# EAGLE board SP-PC-1 (EAGLE 7.7.0), part 1 of 2
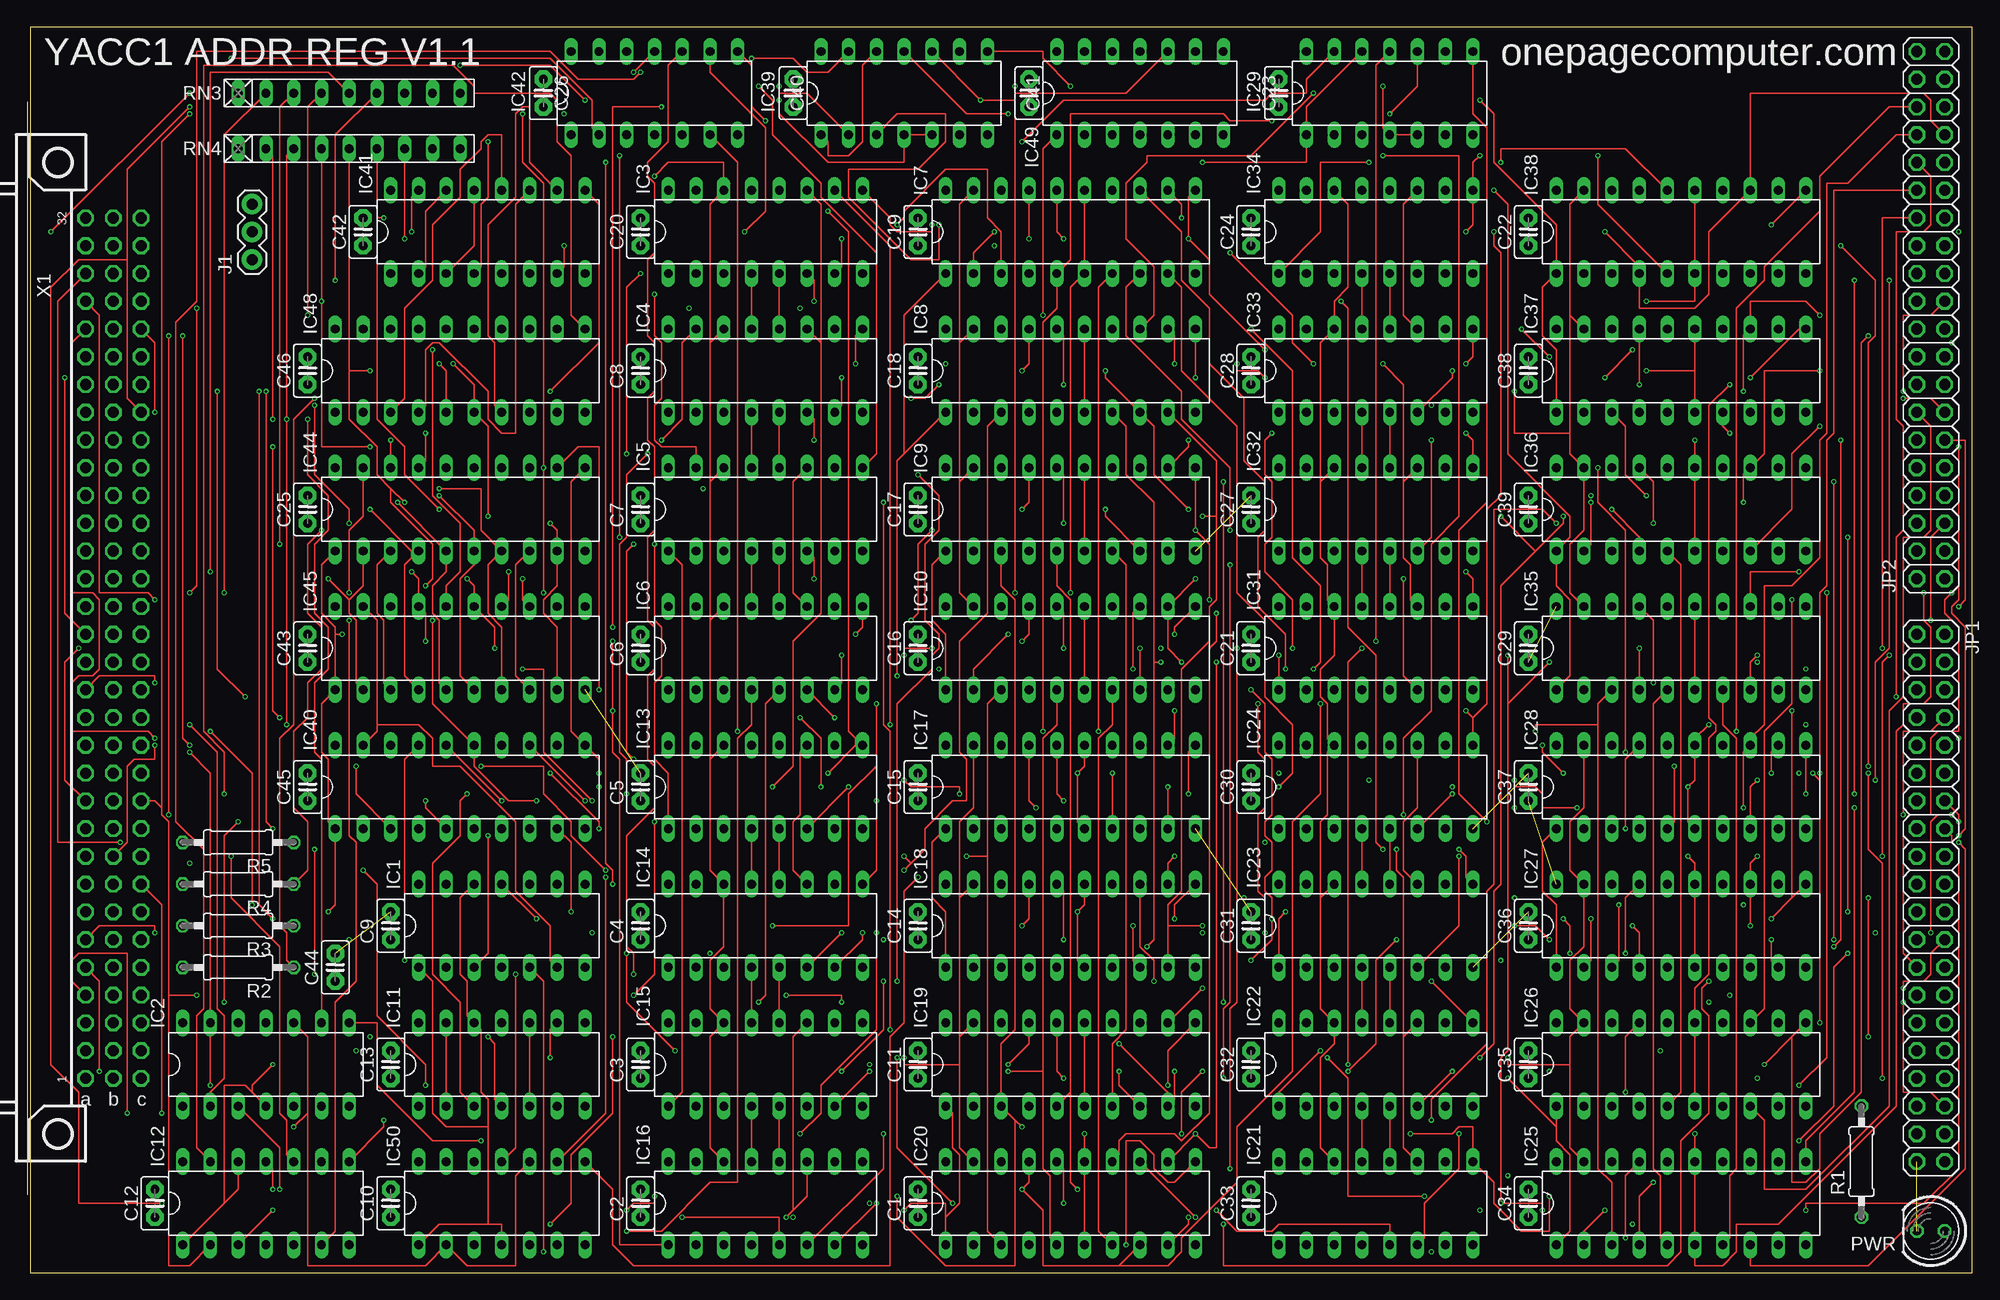
[diagram p8: board, top side]
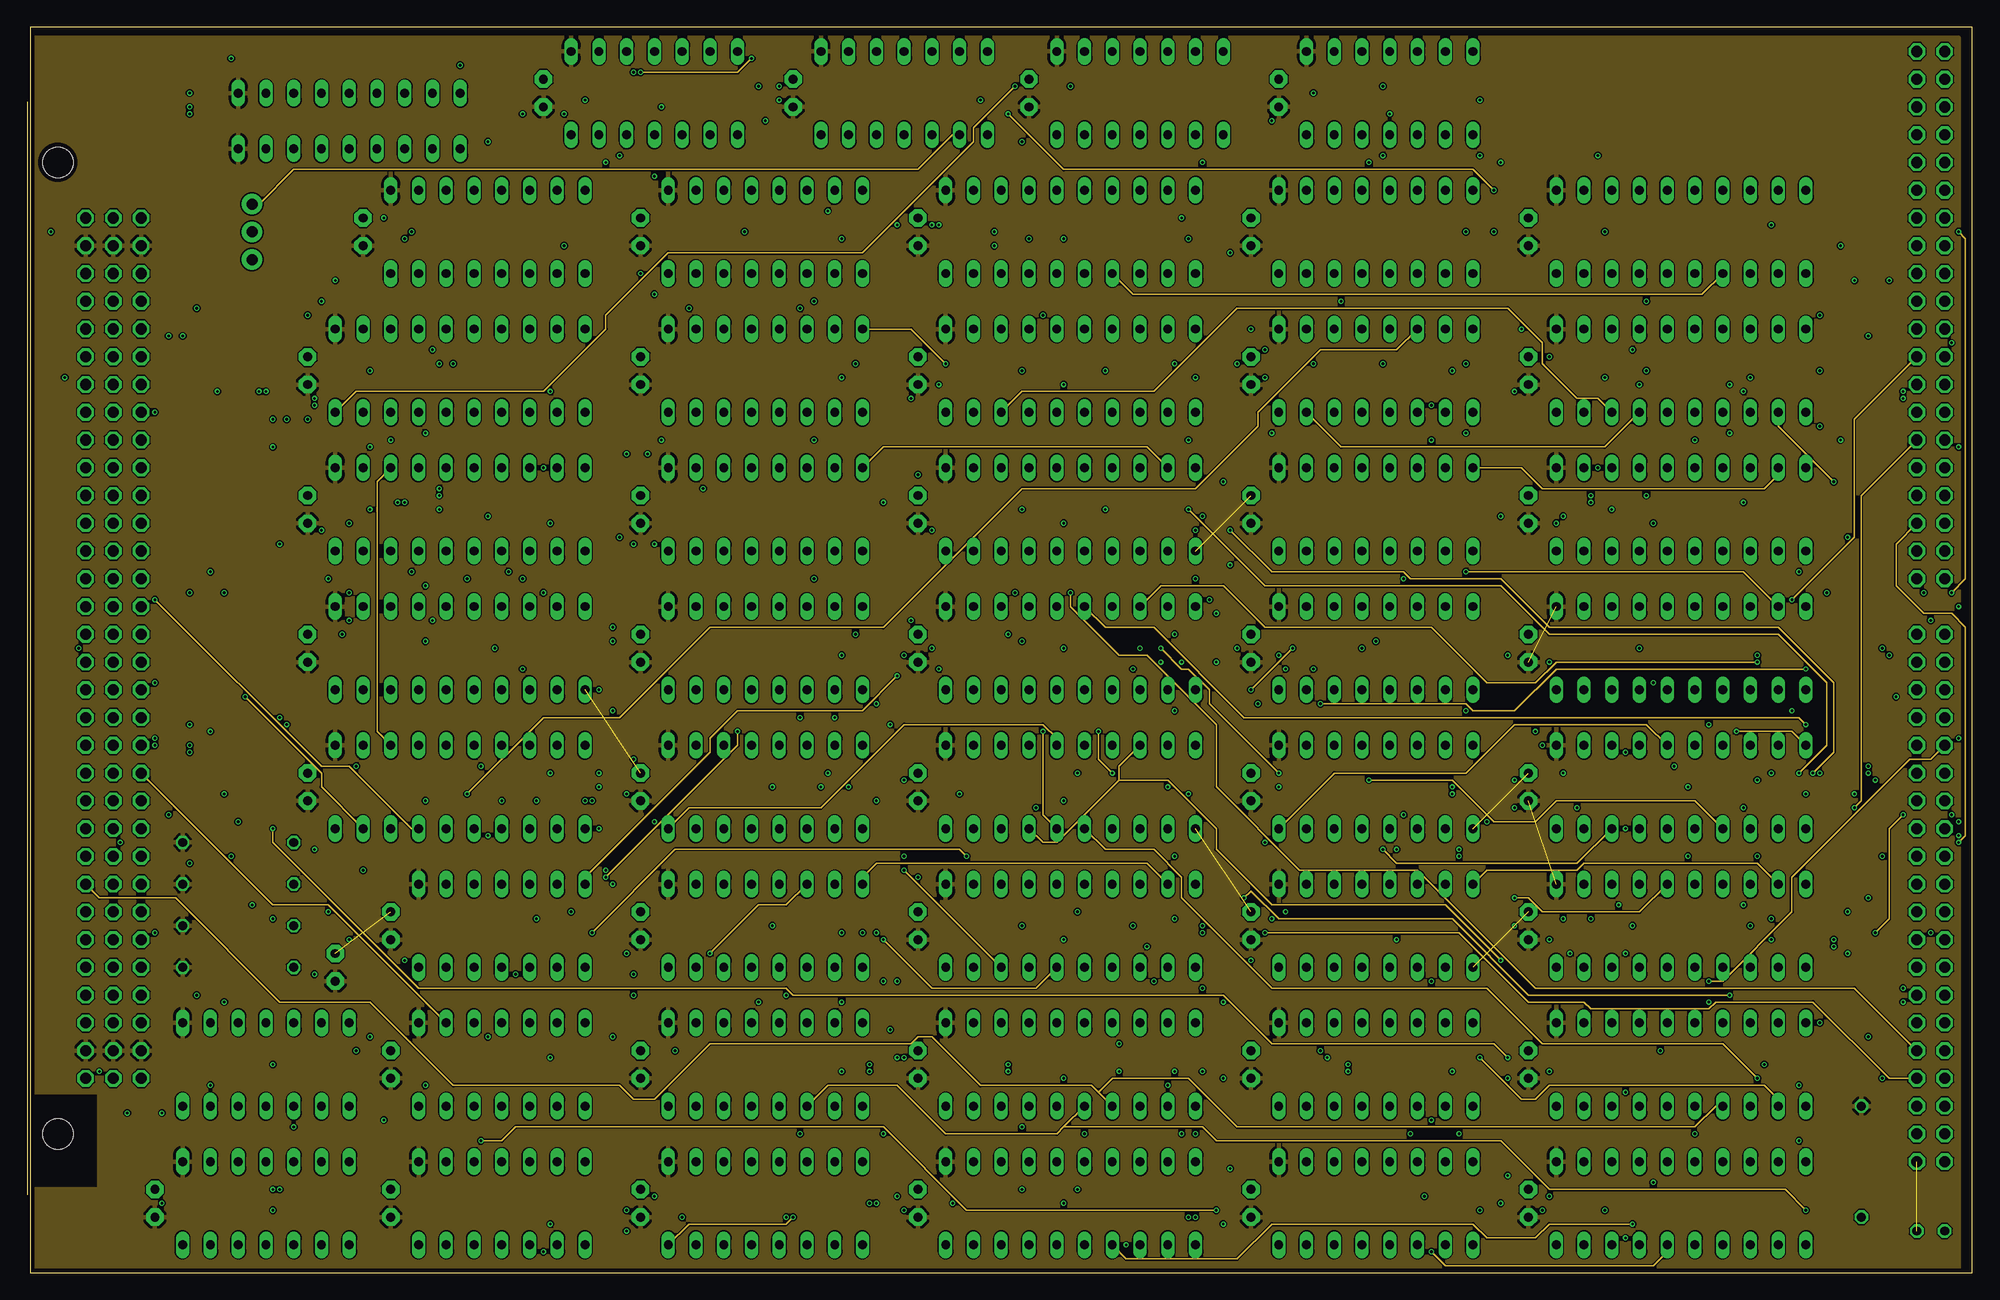
[diagram p9: board, inner layer Route2]
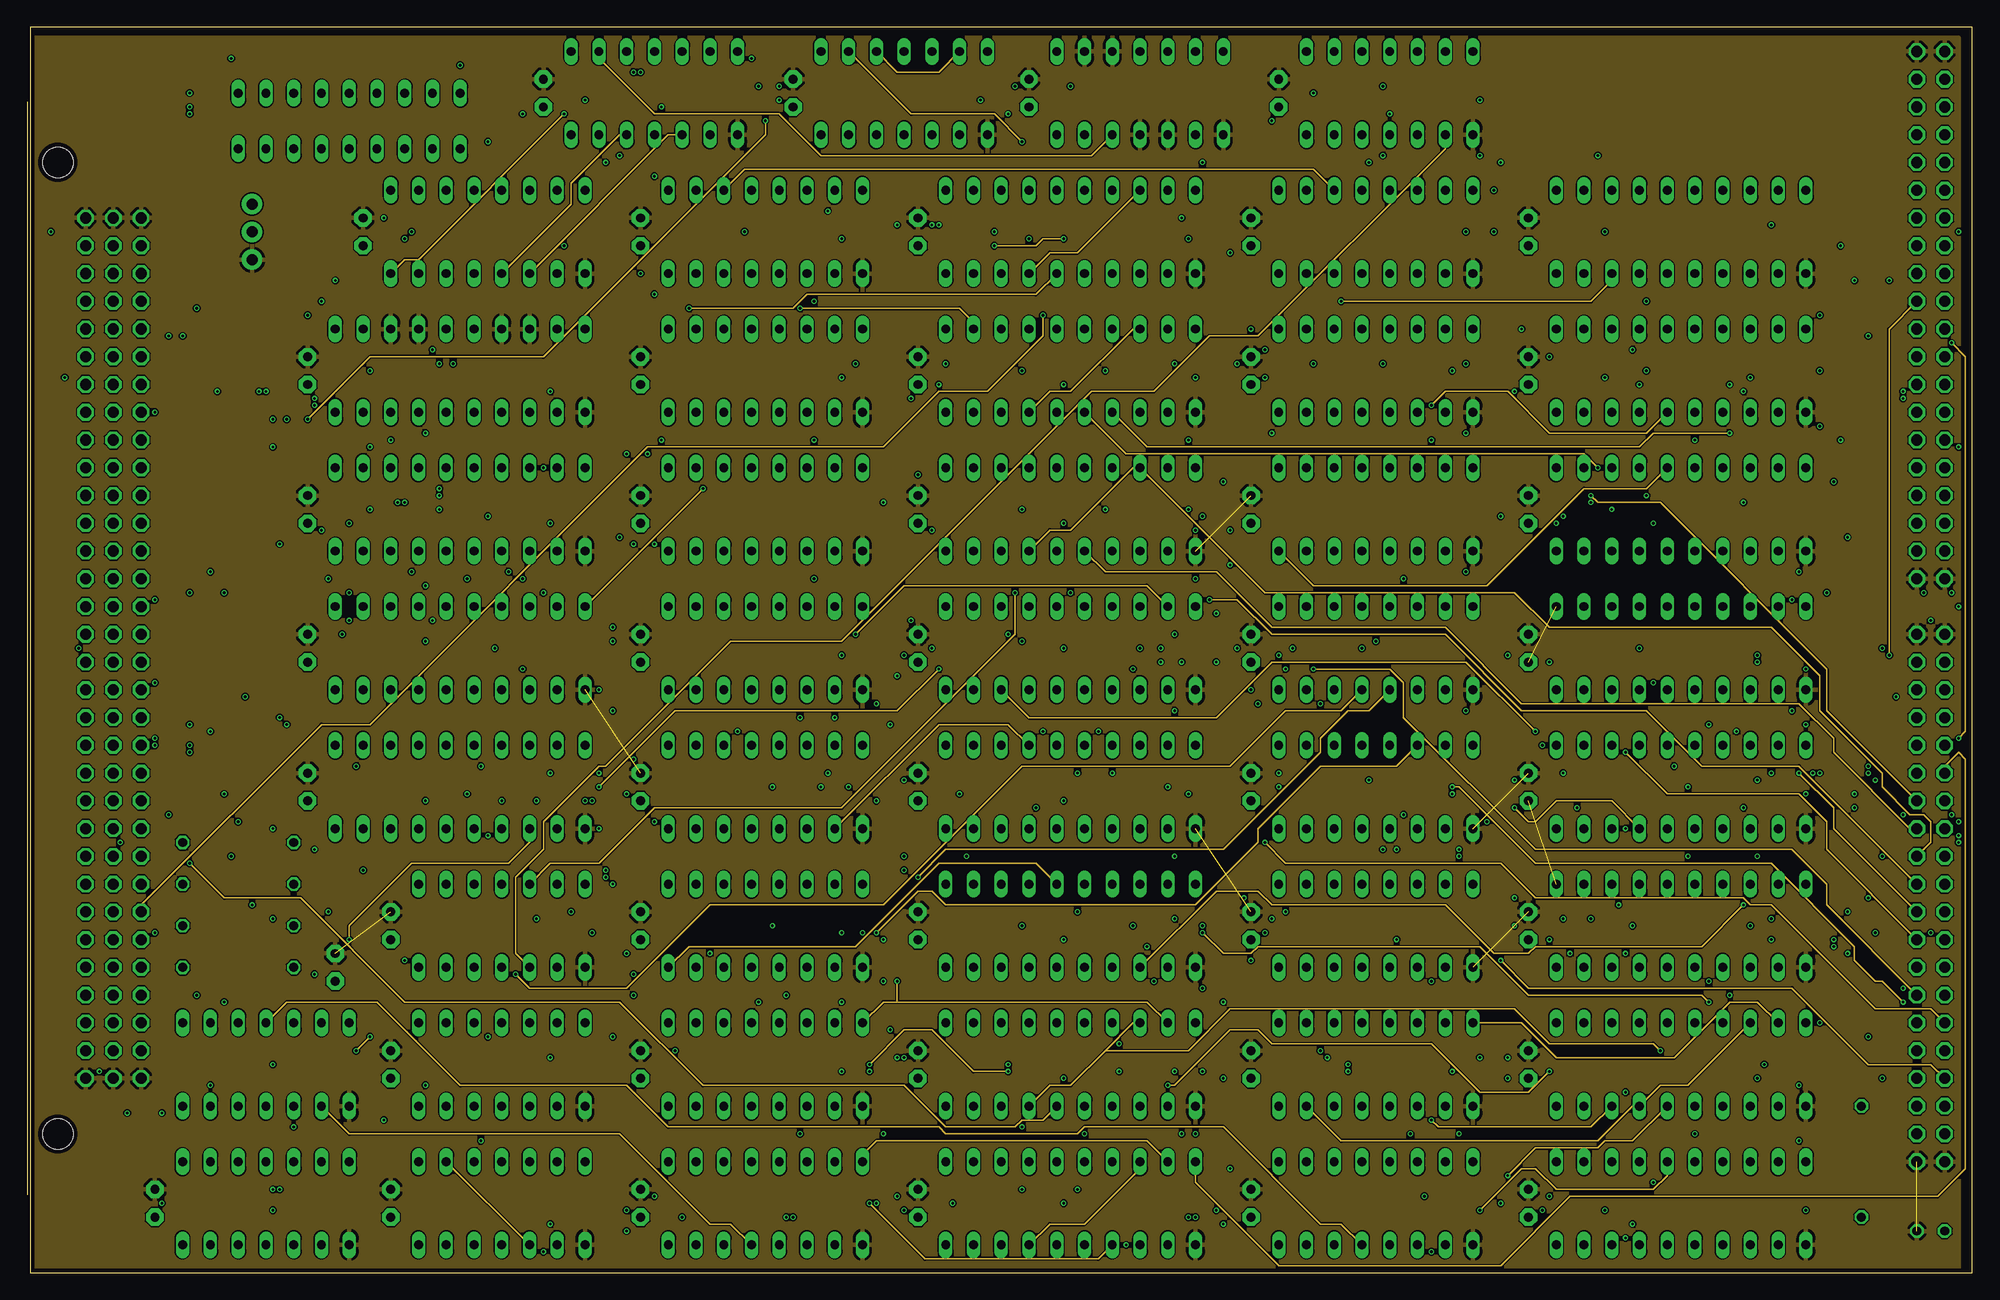
[diagram p10: board, inner layer Route15]
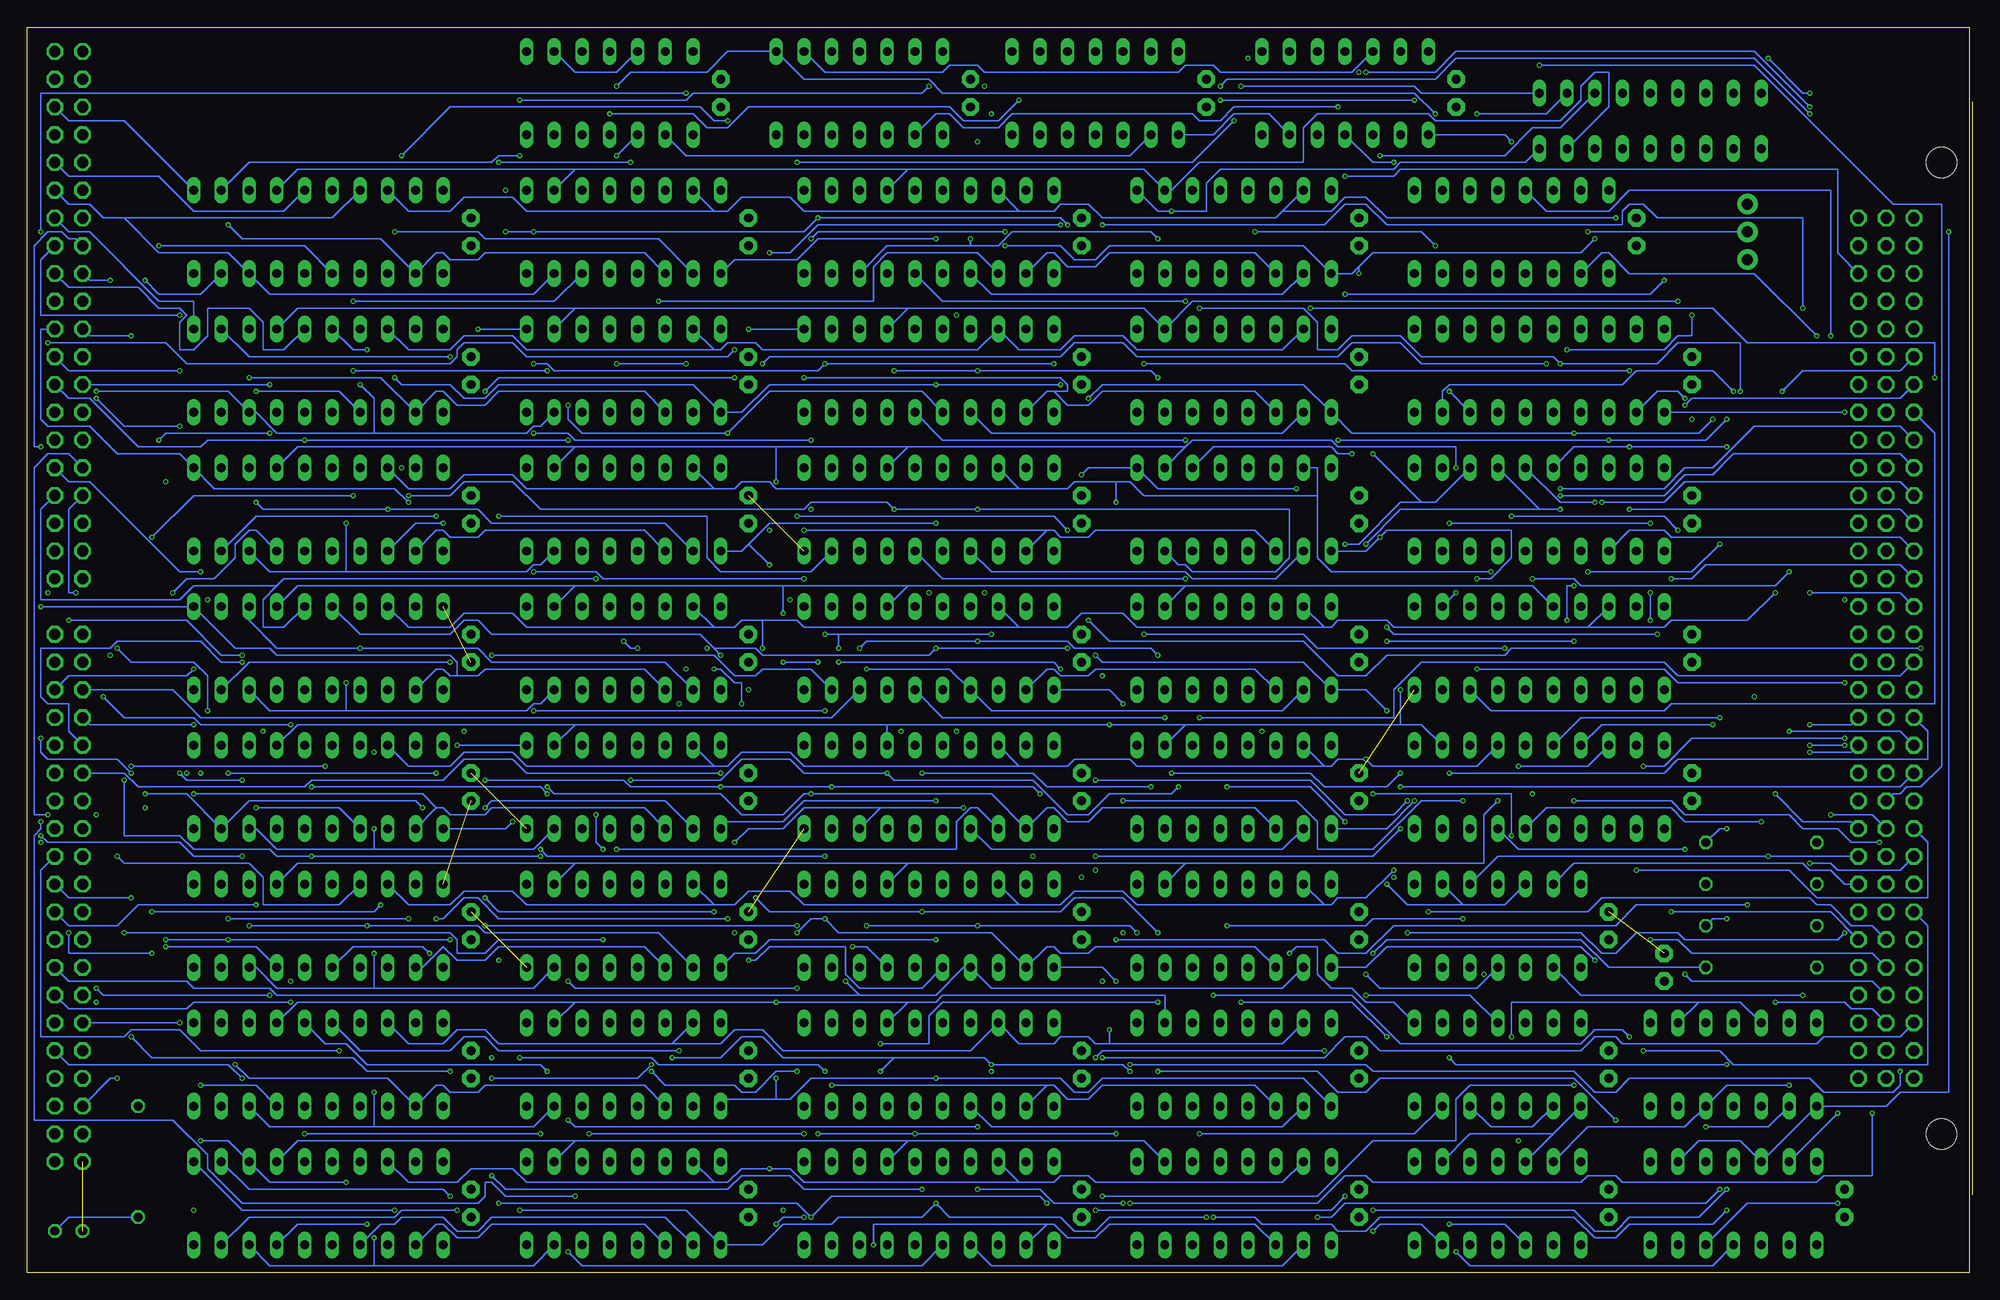
[diagram p11: board, bottom side, seen from below]

Size 177.78 x 113.97 mm. Coordinates in mm from the lower left corner, seen from the top.
Outline: 0,0 177.78,0 177.78,113.97 0,113.97 0,0
Copper layers (1*2*15*16): Top 0.035559375mm / dielectric 0.17018125mm / Route2 0.01778125mm / dielectric 47mil / Route15 0.01778125mm / dielectric 0.17018125mm / Bottom 0.035559375mm
Design rules "OSHPark-4layer *": minimum track width 5mil, minimum drill 10mil, track to track 5mil, track to pad 5mil, pad to pad 5mil, via to via 5mil, smd to smd 5mil, copper to edge 15mil, drill to drill 6mil, minimum pad ring 4mil, minimum via ring 4mil, stop-mask expansion 2.5mil, vias tented up to drill 0mil, thermal gap 10mil

## Footprints (pad centres in the part's own frame; a part is rotated, then mirrored left to right if it is on the bottom)
C2.5-2 = drill 0.813 pad 1.6 octagon: 1 -1.27,0; 2 1.27,0
DIL14 = drill 0.813 long: 1 -7.62,-3.81; 2 -5.08,-3.81; 3 -2.54,-3.81; 4 0,-3.81; 5 2.54,-3.81; 6 5.08,-3.81; 7 7.62,-3.81; 8 7.62,3.81; 9 5.08,3.81; 10 2.54,3.81; 11 0,3.81; 12 -2.54,3.81; 13 -5.08,3.81; 14 -7.62,3.81
DIL16 = drill 0.813 long: 1 -8.89,-3.81; 2 -6.35,-3.81; 3 -3.81,-3.81; 4 -1.27,-3.81; 5 1.27,-3.81; 6 3.81,-3.81; 7 6.35,-3.81; 8 8.89,-3.81; 9 8.89,3.81; 10 6.35,3.81; 11 3.81,3.81; 12 1.27,3.81; 13 -1.27,3.81; 14 -3.81,3.81; 15 -6.35,3.81; 16 -8.89,3.81
DIL20 = drill 0.813 long: 1 -11.43,-3.81; 2 -8.89,-3.81; 3 -6.35,-3.81; 4 -3.81,-3.81; 5 -1.27,-3.81; 6 1.27,-3.81; 7 3.81,-3.81; 8 6.35,-3.81; 9 8.89,-3.81; 10 11.43,-3.81; 11 11.43,3.81; 12 8.89,3.81; 13 6.35,3.81; 14 3.81,3.81; 15 1.27,3.81; 16 -1.27,3.81; 17 -3.81,3.81; 18 -6.35,3.81; 19 -8.89,3.81; 20 -11.43,3.81
1X03 = drill 1.016 pad 1.88: 1 0,0; 2 2.54,0; 3 5.08,0
2X20 = drill 1.016 octagon: 1 -24.13,-1.27; 2 -24.13,1.27; 3 -21.59,-1.27; 4 -21.59,1.27; 5 -19.05,-1.27; 6 -19.05,1.27; 7 -16.51,-1.27; 8 -16.51,1.27; 9 -13.97,-1.27; 10 -13.97,1.27; 11 -11.43,-1.27; 12 -11.43,1.27; 13 -8.89,-1.27; 14 -8.89,1.27; 15 -6.35,-1.27; 16 -6.35,1.27; 17 -3.81,-1.27; 18 -3.81,1.27; 19 -1.27,-1.27; 20 -1.27,1.27; 21 1.27,-1.27; 22 1.27,1.27; 23 3.81,-1.27; 24 3.81,1.27; 25 6.35,-1.27; 26 6.35,1.27; 27 8.89,-1.27; 28 8.89,1.27; 29 11.43,-1.27; 30 11.43,1.27; 31 13.97,-1.27; 32 13.97,1.27; 33 16.51,-1.27; 34 16.51,1.27; 35 19.05,-1.27; 36 19.05,1.27; 37 21.59,-1.27; 38 21.59,1.27; 39 24.13,-1.27; 40 24.13,1.27
LED5MM = drill 0.813 octagon: A -1.27,0; K 1.27,0
0207/10 = drill 0.813 octagon: 1 -5.08,0; 2 5.08,0
RN-9 = drill 0.813 long: 1 -10.16,0; 2 -7.62,0; 3 -5.08,0; 4 -2.54,0; 5 0,0; 6 2.54,0; 7 5.08,0; 8 7.62,0; 9 10.16,0
FABC96R = drill 1.016 octagon: A1 -2.54,39.37; A2 -2.54,36.83; A3 -2.54,34.29; A4 -2.54,31.75; A5 -2.54,29.21; A6 -2.54,26.67; A7 -2.54,24.13; A8 -2.54,21.59; A9 -2.54,19.05; A10 -2.54,16.51; A11 -2.54,13.97; A12 -2.54,11.43; A13 -2.54,8.89; A14 -2.54,6.35; A15 -2.54,3.81; A16 -2.54,1.27; A17 -2.54,-1.27; A18 -2.54,-3.81; A19 -2.54,-6.35; A20 -2.54,-8.89; A21 -2.54,-11.43; A22 -2.54,-13.97; A23 -2.54,-16.51; A24 -2.54,-19.05; A25 -2.54,-21.59; A26 -2.54,-24.13; A27 -2.54,-26.67; A28 -2.54,-29.21; A29 -2.54,-31.75; A30 -2.54,-34.29; A31 -2.54,-36.83; A32 -2.54,-39.37; B1 -5.08,39.37; B2 -5.08,36.83; B3 -5.08,34.29; B4 -5.08,31.75; B5 -5.08,29.21; B6 -5.08,26.67; B7 -5.08,24.13; B8 -5.08,21.59; B9 -5.08,19.05; B10 -5.08,16.51; B11 -5.08,13.97; B12 -5.08,11.43; B13 -5.08,8.89; B14 -5.08,6.35; B15 -5.08,3.81; B16 -5.08,1.27; B17 -5.08,-1.27; B18 -5.08,-3.81; B19 -5.08,-6.35; B20 -5.08,-8.89; B21 -5.08,-11.43; B22 -5.08,-13.97; B23 -5.08,-16.51; B24 -5.08,-19.05; B25 -5.08,-21.59; B26 -5.08,-24.13; B27 -5.08,-26.67; B28 -5.08,-29.21; B29 -5.08,-31.75; B30 -5.08,-34.29; B31 -5.08,-36.83; B32 -5.08,-39.37; C1 -7.62,39.37; C2 -7.62,36.83; C3 -7.62,34.29; C4 -7.62,31.75; C5 -7.62,29.21; C6 -7.62,26.67; C7 -7.62,24.13; C8 -7.62,21.59; C9 -7.62,19.05; C10 -7.62,16.51; C11 -7.62,13.97; C12 -7.62,11.43; C13 -7.62,8.89; C14 -7.62,6.35; C15 -7.62,3.81; C16 -7.62,1.27; C17 -7.62,-1.27; C18 -7.62,-3.81; C19 -7.62,-6.35; C20 -7.62,-8.89; C21 -7.62,-11.43; C22 -7.62,-13.97; C23 -7.62,-16.51; C24 -7.62,-19.05; C25 -7.62,-21.59; C26 -7.62,-24.13; C27 -7.62,-26.67; C28 -7.62,-29.21; C29 -7.62,-31.75; C30 -7.62,-34.29; C31 -7.62,-36.83; C32 -7.62,-39.37 | hole 2.794: 0,-44.456; 0,44.456

## Placement (x,y rotation side)
C1  0.1  [C2.5-2]  81.28,6.35 90 top
C2  0.1  [C2.5-2]  55.88,6.35 90 top
C3  0.1  [C2.5-2]  55.88,19.05 90 top
C4  0.1  [C2.5-2]  55.88,31.75 90 top
C5  0.1  [C2.5-2]  55.88,44.45 90 top
C6  0.1  [C2.5-2]  55.88,57.15 90 top
C7  0.1  [C2.5-2]  55.88,69.85 90 top
C8  0.1  [C2.5-2]  55.88,82.55 90 top
C9  0.1  [C2.5-2]  33.02,31.75 90 top
C10  0.1  [C2.5-2]  33.02,6.35 90 top
C11  0.1  [C2.5-2]  81.28,19.05 90 top
C12  0.1  [C2.5-2]  11.43,6.35 90 top
C13  0.1  [C2.5-2]  33.02,19.05 90 top
C14  0.1  [C2.5-2]  81.28,31.75 90 top
C15  0.1  [C2.5-2]  81.28,44.45 90 top
C16  0.1  [C2.5-2]  81.28,57.15 90 top
C17  0.1  [C2.5-2]  81.28,69.85 90 top
C18  0.1  [C2.5-2]  81.28,82.55 90 top
C19  0.1  [C2.5-2]  81.28,95.25 90 top
C20  0.1  [C2.5-2]  55.88,95.25 90 top
C21  0.1  [C2.5-2]  111.76,57.15 90 top
C22  0.1  [C2.5-2]  137.16,95.25 90 top
C23  0.1  [C2.5-2]  114.3,107.95 90 top
C24  0.1  [C2.5-2]  111.76,95.25 90 top
C25  0.1  [C2.5-2]  25.4,69.85 90 top
C26  0.1  [C2.5-2]  46.99,107.95 90 top
C27  0.1  [C2.5-2]  111.76,69.85 90 top
C28  0.1  [C2.5-2]  111.76,82.55 90 top
C29  0.1  [C2.5-2]  137.16,57.15 90 top
C30  0.1  [C2.5-2]  111.76,44.45 90 top
C31  0.1  [C2.5-2]  111.76,31.75 90 top
C32  0.1  [C2.5-2]  111.76,19.05 90 top
C33  0.1  [C2.5-2]  111.76,6.35 90 top
C34  0.1  [C2.5-2]  137.16,6.35 90 top
C35  0.1  [C2.5-2]  137.16,19.05 90 top
C36  0.1  [C2.5-2]  137.16,31.75 90 top
C37  0.1  [C2.5-2]  137.16,44.45 90 top
C38  0.1  [C2.5-2]  137.16,82.55 90 top
C39  0.1  [C2.5-2]  137.16,69.85 90 top
C40  0.1  [C2.5-2]  69.85,107.95 90 top
C41  0.1  [C2.5-2]  91.44,107.95 90 top
C42  0.1  [C2.5-2]  30.48,95.25 90 top
C43  0.1  [C2.5-2]  25.4,57.15 90 top
C44  0.1  [C2.5-2]  27.94,27.94 90 top
C45  0.1  [C2.5-2]  25.4,44.45 90 top
C46  0.1  [C2.5-2]  25.4,82.55 90 top
IC1  7400N  [DIL14]  43.18,31.75 0 top
IC2  74LS08N  [DIL14]  21.59,19.05 0 top
IC3  74LS192N  [DIL16]  67.31,95.25 0 top
IC4  74LS192N  [DIL16]  67.31,82.55 0 top
IC5  74LS192N  [DIL16]  67.31,69.85 0 top
IC6  74LS192N  [DIL16]  67.31,57.15 0 top
IC7  74LS244N  [DIL20]  95.25,95.25 0 top
IC8  74LS244N  [DIL20]  95.25,82.55 0 top
IC9  74LS244N  [DIL20]  95.25,69.85 0 top
IC10  74LS244N  [DIL20]  95.25,57.15 0 top
IC11  7400N  [DIL14]  43.18,19.05 0 top
IC12  7400N  [DIL14]  21.59,6.35 0 top
IC13  74LS192N  [DIL16]  67.31,44.45 0 top
IC14  74LS192N  [DIL16]  67.31,31.75 0 top
IC15  74LS192N  [DIL16]  67.31,19.05 0 top
IC16  74LS192N  [DIL16]  67.31,6.35 0 top
IC17  74LS244N  [DIL20]  95.25,44.45 0 top
IC18  74LS244N  [DIL20]  95.25,31.75 0 top
IC19  74LS244N  [DIL20]  95.25,19.05 0 top
IC20  74LS244N  [DIL20]  95.25,6.35 0 top
IC21  74LS192N  [DIL16]  123.19,6.35 0 top
IC22  74LS192N  [DIL16]  123.19,19.05 0 top
IC23  74LS192N  [DIL16]  123.19,31.75 0 top
IC24  74LS192N  [DIL16]  123.19,44.45 0 top
IC25  74LS244N  [DIL20]  151.13,6.35 0 top
IC26  74LS244N  [DIL20]  151.13,19.05 0 top
IC27  74LS244N  [DIL20]  151.13,31.75 0 top
IC28  74LS244N  [DIL20]  151.13,44.45 0 top
IC29  7400N  [DIL14]  124.46,107.95 0 top
IC31  74LS192N  [DIL16]  123.19,57.15 0 top
IC32  74LS192N  [DIL16]  123.19,69.85 0 top
IC33  74LS192N  [DIL16]  123.19,82.55 0 top
IC34  74LS192N  [DIL16]  123.19,95.25 0 top
IC35  74LS244N  [DIL20]  151.13,57.15 0 top
IC36  74LS244N  [DIL20]  151.13,69.85 0 top
IC37  74LS244N  [DIL20]  151.13,82.55 0 top
IC38  74LS244N  [DIL20]  151.13,95.25 0 top
IC39  7400N  [DIL14]  80.01,107.95 0 top
IC40  74LS245N  [DIL20]  39.37,44.45 0 top
IC41  74LS139N  [DIL16]  41.91,95.25 0 top
IC42  74LS04N  [DIL14]  57.15,107.95 0 top
IC44  74LS245N  [DIL20]  39.37,69.85 0 top
IC45  74LS245N  [DIL20]  39.37,57.15 0 top
IC48  74LS374N  [DIL20]  39.37,82.55 0 top
IC49  74LS32N  [DIL14]  101.6,107.95 0 top
IC50  74LS08N  [DIL14]  43.18,6.35 0 top
J1  [1X03]  20.32,92.71 90 top
JP1  [2X20]  173.99,34.29 270 top
JP2  [2X20]  173.99,87.63 90 top
PWR  l1  [LED5MM]  173.99,3.81 180 top
R1  330  [0207/10]  167.64,10.16 90 top
R2  10k  [0207/10]  19.05,27.94 180 top
R3  10k  [0207/10]  19.05,31.75 180 top
R4  10k  [0207/10]  19.05,35.56 180 top
R5  10k  [0207/10]  19.05,39.37 180 top
RN3  [RN-9]  29.21,107.95 0 top
RN4  [RN-9]  29.21,102.87 0 top
X1  FABC96R  [FABC96R]  2.54,57.15 180 top

## Tracks (layer width: path | path; a pad name or v marks a point on that pad's centre or on a via)
-BUS-EN  (via drill 0.25)
  Top 0.127: v11.43,78.74 11.43,85.09 X1.C28 | IC49.10 100.33,107.95 90.17,107.95 v90.17,108.58
  Route2 0.127: v90.17,108.58 86.36,104.78 86.36,103.5 76.2,93.34 58.42,93.34 52.7,87.63 52.7,86.36 46.99,80.64 29.84,80.64 IC48.1
  Bottom 0.127: v11.43,78.74 IC48.1
-INDIRECT0
  Route15 0.127: IC41.6 58.42,104.14 IC42.5
-INDIRECT1  (via drill 0.25)
  Top 0.127: IC41.7 48.9,92.08 v48.9,93.98 | v65.41,95.25 67.31,97.16 67.31,104.78 62.23,109.86 IC42.9
  Bottom 0.127: v48.9,93.98 50.16,95.25 v65.41,95.25
-IREG0-ADDR-OUT  (via drill 0.25)
  Top 0.127: IC35.19 140.97,62.23 140.97,66.67 142.24,67.94 IC36.19 140.97,74.93 140.97,76.83 | 140.97,87.63 IC37.19 | 140.97,87.63 140.97,97.79 IC38.19 | 140.97,87.63 140.97,76.83 | R4.1 25.4,36.83 25.4,41.27 24.13,42.55 24.13,49.53 25.4,50.8 25.4,53.98 26.67,55.24 26.67,59.05 25.4,60.33 25.4,66.67 v26.67,67.94 | v41.91,69.22 41.91,77.47 IC48.6 40.64,81.28 v38.73,83.19 | 140.97,76.83 135.89,76.83 v135.89,80.64 | v113.03,81.92 112.39,82.55 110.49,82.55 v110.49,83.19
  Bottom 0.127: v26.67,67.94 27.94,69.22 v41.91,69.22 | v135.89,80.64 134.62,81.92 v113.03,81.92 | v110.49,83.19 109.86,83.82 83.19,83.82 81.92,85.09 77.47,85.09 76.2,83.82 57.78,83.82 56.52,85.09 52.07,85.09 50.16,83.19 v38.73,83.19
-IREG1-ADDR-OUT  (via drill 0.25)
  Top 0.127: IC25.19 140.97,11.43 140.97,19.05 | 140.97,19.05 140.97,21.59 IC26.19 140.97,24.13 140.97,28.57 142.24,29.84 IC27.19 140.97,36.83 140.97,41.27 142.24,42.55 IC28.19 | v22.23,40.64 21.59,41.27 v21.59,80.64 | 140.97,19.05 135.25,19.05 v135.25,19.68
  Route2 0.127: v135.25,19.68 133.99,20.95 113.67,20.95 109.22,25.4 69.85,25.4 69.22,26.04 35.56,26.04 22.23,39.37 v22.23,40.64
  Bottom 0.127: R5.1 22.86,40.64 v22.23,40.64 | v21.59,80.64 23.5,82.55 30.48,82.55 31.75,81.28 47.62,81.28 48.26,80.64 IC48.9
-PC
  Route15 0.127: IC41.5 49.53,97.79 49.53,99.69 53.98,104.14 IC42.3
-PC-ADDR-OUT  (via drill 0.25)
  Top 0.127: IC20.19 85.09,11.43 85.09,19.05 | 85.09,21.59 85.09,19.05 | IC19.19 85.09,21.59 | 85.09,34.29 IC18.19 | 85.09,21.59 85.09,34.29 | IC17.19 86.36,42.55 85.09,41.27 85.09,34.29 | R2.1 23.5,28.57 23.5,31.11 22.86,31.75 22.86,48.9 24.13,50.16 24.13,78.11 v26.04,80.01 | 85.09,19.05 80.01,19.05 v80.01,19.68 | v59.05,20.32 54.61,24.77 v54.61,29.21
  Bottom 0.127: v26.04,80.01 26.67,80.64 28.57,80.64 IC48.2 | v80.01,19.68 79.38,20.32 v59.05,20.32 | v54.61,29.21 53.34,30.48 35.56,30.48 33.02,27.94 R2.1
-SP  (via drill 0.25)
  Top 0.127: IC41.4 41.27,92.08 41.27,97.79 41.91,98.42 v41.91,103.5
  Bottom 0.127: v41.91,103.5 42.55,104.14 IC42.1
-SP-ADDR-OUT  (via drill 0.25)
  Top 0.127: IC10.19 85.09,62.23 85.09,72.39 | IC9.19 85.09,72.39 | 85.09,85.09 IC8.19 | 85.09,72.39 85.09,85.09 | IC7.19 85.09,97.79 85.09,85.09 | v22.23,32.38 20.95,33.66 v20.95,80.64 | v37.47,83.19 38.1,82.55 IC48.5
  Route15 0.127: IC8.19 86.36,87 85.09,88.27 v70.48,88.27
  Bottom 0.127: R3.1 23.5,32.38 v22.23,32.38 | v20.95,80.64 20.95,85.09 26.67,85.09 28.57,83.19 v37.47,83.19 38.1,83.82 50.16,83.82 52.07,85.72 56.52,85.72 57.78,84.45 59.69,84.45 59.69,87 60.96,88.27 v70.48,88.27
ADATA0  (via drill 0.25)
  Top 0.127: RN3.2 17.78,104.14 v17.78,62.23 | v109.86,9.53 109.86,24.13 110.49,24.77 v110.49,57.15
  Bottom 0.127: IC16.15 62.87,8.26 80.01,8.26 80.64,8.89 83.19,8.89 83.82,8.26 87,8.26 | IC20.18 87,8.26 | 114.94,8.26 IC21.15 | 114.94,8.26 113.67,8.26 112.39,9.53 v109.86,9.53 107.95,9.53 106.68,8.26 87,8.26 | IC25.18 142.88,8.26 138.43,8.26 137.16,9.53 133.35,9.53 132.08,8.26 114.94,8.26 | 34.92,59.05 IC45.18 | 34.92,59.05 52.7,59.05 53.34,59.69 57.78,59.69 58.42,59.05 59.05,59.05 | IC6.15 59.05,59.05 | 87,59.05 IC10.18 | 87,59.05 82.55,59.05 81.28,60.33 77.47,60.33 76.2,59.05 59.05,59.05 | 114.94,59.05 IC31.15 | 114.94,59.05 113.03,59.05 112.39,59.69 110.49,59.69 | 110.49,59.69 107.31,59.69 106.68,59.05 87,59.05 | IC35.18 142.88,59.05 139.06,59.05 137.79,60.33 133.35,60.33 132.08,59.05 114.94,59.05 | v17.78,62.23 20.32,59.69 27.3,59.69 27.94,59.05 34.92,59.05 | 110.49,59.69 v110.49,57.15
ADATA1  (via drill 0.25)
  Top 0.127: v114.3,56.52 IC31.1 | IC10.16 94.61,60.33 v94.61,57.15 | IC20.16 94.61,9.53 v94.61,6.35 | IC16.1 53.98,2.54 53.98,46.99 53.34,47.62 v53.34,51.44 v53.34,57.78 | v36.2,57.78 36.2,60.33 IC45.17 35.56,63.5 v34.92,64.14 | RN3.3 22.86,106.68 v22.86,66.67 | v82.55,57.15 80.01,57.15 v80.01,56.52
  Route2 0.127: v69.85,5.08 69.22,4.45 60.33,4.45 IC16.1
  Route15 0.127: IC25.16 149.86,8.89 148.59,7.62 139.7,7.62 137.79,9.53 136.53,9.53 v132.72,5.71
  Bottom 0.127: 114.94,57.15 116.2,58.42 135.25,58.42 136.53,59.69 137.79,59.69 139.06,58.42 147.32,58.42 IC35.16 | 114.94,57.15 v114.3,56.52 | 114.94,57.15 111.12,57.15 110.49,56.52 95.25,56.52 v94.61,57.15 v82.55,57.15 | v132.72,5.71 117.47,5.71 IC21.1 110.49,2.54 108.58,4.45 104.14,4.45 103.5,5.08 95.89,5.08 v94.61,6.35 93.34,5.08 83.19,5.08 81.92,3.81 80.01,3.81 78.74,5.08 v69.85,5.08 | v53.34,51.44 55.24,53.34 IC6.1 60.96,55.88 79.38,55.88 v80.01,56.52 | v53.34,57.78 v36.2,57.78 | v22.86,66.67 25.4,64.14 v34.92,64.14
ADATA2  (via drill 0.25)
  Top 0.127: RN3.4 25.4,106.68 v25.4,87.63 | v36.83,84.45 36.83,71.12 39.37,68.58 39.37,64.14 38.1,62.87 IC45.16 | IC20.14 99.69,10.79 99.69,12.06 100.33,12.7 104.78,12.7 105.41,12.06 107.95,14.61 107.95,57.15 108.58,57.78 v108.58,60.33
  Bottom 0.127: IC16.10 75.56,12.06 97.16,12.06 | IC20.14 97.16,12.06 | 127.64,12.06 IC21.10 | 97.16,12.06 127.64,12.06 | IC25.14 153.03,12.06 127.64,12.06 | IC45.16 40.01,62.87 71.75,62.87 | IC6.10 71.75,62.87 | 97.16,62.87 IC10.14 | 71.75,62.87 97.16,62.87 | v25.4,87.63 25.4,85.72 26.67,85.72 27.94,84.45 v36.83,84.45 | 127.64,62.87 IC31.10 | 97.16,62.87 108.58,62.87 | 108.58,62.87 127.64,62.87 | IC35.14 153.03,62.87 127.64,62.87 | 108.58,62.87 v108.58,60.33
ADATA3  (via drill 0.25)
  Top 0.127: v139.06,6.99 139.06,3.81 136.53,3.81 133.99,6.35 133.99,8.26 IC21.9 132.08,13.34 130.81,13.34 130.18,12.7 v126.36,12.7 | IC20.12 v106.68,12.7 107.95,11.43 108.58,11.43 v108.58,55.88 | v106.68,63.5 IC10.12 104.14,57.15 v105.41,55.88 | v131.44,64.14 132.08,63.5 IC31.9 | v42.55,57.15 42.55,59.05 IC45.15 40.64,62.87 v40.01,63.5 | v75.56,58.42 76.2,59.05 IC6.9 | RN3.5 27.3,109.86 16.51,109.86 v16.51,64.14
  Route2 0.127: IC35.12 156.84,64.14 v131.44,64.14
  Route15 0.127: IC16.9 76.2,10.79 77.47,12.06 102.23,12.06 IC20.12 | IC10.12 102.23,62.87 80.01,62.87 v75.56,58.42
  Bottom 0.127: v139.06,6.99 139.7,7.62 157.48,7.62 IC25.12 | v126.36,12.7 v106.68,12.7 | v106.68,63.5 125.09,63.5 125.73,64.14 v131.44,64.14 | v42.55,57.15 59.69,57.15 60.96,58.42 v75.56,58.42 | v16.51,64.14 17.78,62.87 35.56,62.87 36.2,63.5 v40.01,63.5 | v105.41,55.88 v108.58,55.88
ADATA4  (via drill 0.25)
  Top 0.127: IC45.14 43.81,61.59 v43.81,64.14 | RN3.6 27.94,104.14 v27.94,90.81 | v57.15,89.53 57.15,85.72 57.78,85.09 57.78,80.01 57.15,79.38 57.15,76.2 57.78,75.56 60.96,75.56 IC5.15 | v78.74,22.23 78.74,49.53 78.11,50.16 v78.11,70.48
  Bottom 0.127: IC15.15 62.87,20.95 78.74,20.95 | 78.74,20.95 80.01,20.95 80.64,21.59 83.19,21.59 83.82,20.95 87,20.95 IC19.18 91.44,20.32 108.58,20.32 110.49,22.23 113.03,22.23 114.3,20.95 118.75,20.95 | 118.75,20.95 IC22.15 | 118.75,20.95 134.62,20.95 135.89,22.23 138.43,22.23 139.7,20.95 142.88,20.95 IC26.18 | v43.81,64.14 58.42,64.14 59.69,65.41 59.69,71.12 | 59.69,71.12 59.69,73.66 IC5.15 | v27.94,90.81 29.21,89.53 v57.15,89.53 | 87,71.75 IC9.18 | 87,71.75 82.55,71.75 81.92,72.39 78.11,72.39 | 78.11,72.39 76.83,72.39 75.56,71.12 59.69,71.12 | 114.94,71.75 IC32.15 | 114.94,71.75 113.03,71.75 112.39,72.39 109.86,72.39 109.22,71.75 87,71.75 | IC36.18 142.88,71.75 139.06,71.75 137.79,73.03 133.35,73.03 132.08,71.75 114.94,71.75 | v78.74,22.23 78.74,20.95 | 78.11,72.39 v78.11,70.48
ADATA5  (via drill 0.25)
  Top 0.127: IC9.16 94.61,73.03 v94.61,68.58 | v94.61,17.78 93.98,18.41 IC19.16 | v118.11,20.32 114.3,16.51 IC22.1 | IC15.1 59.69,16.51 59.69,64.77 IC5.1 | IC45.13 45.09,61.59 v45.09,63.5 | v53.98,67.31 v53.98,102.23 | v109.86,64.77 109.86,24.77 109.22,24.13 v109.22,17.78
  Route15 0.127: IC36.16 147.96,71.75 142.24,71.75 133.35,62.87 117.47,62.87 IC32.1
  Bottom 0.127: v94.61,68.58 109.86,68.58 111.76,66.67 | 111.76,66.67 112.39,66.04 IC32.1 | IC22.1 113.67,15.88 109.22,15.88 | 109.22,15.88 107.95,15.88 106.05,17.78 v94.61,17.78 83.19,17.78 81.92,16.51 80.64,16.51 79.38,17.78 60.96,17.78 IC15.1 | IC26.16 147.32,20.32 139.06,20.32 137.79,21.59 135.89,21.59 134.62,20.32 v118.11,20.32 | v45.09,63.5 43.81,63.5 41.91,65.41 41.91,67.94 53.34,67.94 v53.98,67.31 55.24,66.04 IC5.1 | RN3.7 37.47,104.78 40.01,104.78 42.55,102.23 v53.98,102.23 | v109.86,64.77 111.76,66.67 | 109.22,15.88 v109.22,17.78
ADATA6  (via drill 0.25)
  Top 0.127: v46.99,62.23 v46.99,73.66 46.99,99.69 45.09,101.6 v45.09,106.05 | v109.22,72.39 v109.22,24.77
  Bottom 0.127: IC15.10 73.66,25.4 93.98,25.4 94.61,24.77 97.16,24.77 | IC19.14 97.16,24.77 | 127.64,24.77 IC22.10 | 97.16,24.77 v109.22,24.77 127.64,24.77 | IC26.14 153.03,24.77 127.64,24.77 | v46.99,62.23 IC45.12 | v46.99,73.66 46.99,75.56 57.78,75.56 58.42,76.2 71.12,76.2 71.75,75.56 | IC5.10 71.75,75.56 | 97.16,75.56 IC9.14 | 71.75,75.56 97.16,75.56 | RN3.8 38.73,106.05 v45.09,106.05 | 127.64,75.56 IC32.10 | 97.16,75.56 109.22,75.56 | 109.22,75.56 127.64,75.56 | IC36.14 153.03,75.56 127.64,75.56 | 109.22,75.56 v109.22,72.39
ADATA7  (via drill 0.25)
  Top 0.127: v128.27,26.67 IC22.9 | IC19.12 v107.31,26.04 | IC9.12 106.05,75.56 v106.05,76.2 | v131.44,76.83 132.08,76.2 IC32.9 | v66.67,108.58 67.94,107.31 67.94,104.14 72.39,99.69 72.39,98.42 77.47,93.34 77.47,74.93 IC5.9 | v79.38,26.67 79.38,52.07 82.55,55.24 82.55,56.52 83.19,57.15 83.19,58.42 81.92,59.69 81.92,66.67 83.19,67.94 83.19,71.12 v81.28,73.03
  Route2 0.127: IC36.12 160.02,73.03 158.75,71.75 138.43,71.75 136.53,73.66 IC32.9 | IC9.12 102.23,75.56 78.11,75.56 IC5.9
  Route15 0.127: IC15.9 78.11,24.77 79.38,24.77 | 79.38,24.77 102.23,24.77 IC19.12 | IC26.12 158.12,24.77 155.57,24.77 150.5,19.68 139.7,19.68 136.53,22.86 IC22.9 | v61.59,71.75 IC45.11 | v79.38,26.67 79.38,24.77
  Bottom 0.127: v128.27,26.67 127.64,26.04 v107.31,26.04 | v106.05,76.2 127.64,76.2 128.27,76.83 v131.44,76.83 | v61.59,71.75 74.3,71.75 IC5.9 80.64,73.66 v81.28,73.03 | RN3.9 50.16,107.95 50.8,108.58 v66.67,108.58
ADATA8  (via drill 0.25)
  Top 0.127: v41.27,46.35 46.99,46.35 46.99,43.81 49.53,41.27 49.53,40.01 v52.7,36.83 | v33.02,76.2 IC44.18 | v57.78,76.2 59.69,78.11 59.69,85.09 IC4.15 | RN4.2 22.23,102.23 v22.23,78.11
  Route2 0.127: IC40.18 31.75,49.53 31.75,72.39 IC44.18
  Bottom 0.127: IC40.18 34.92,46.35 v41.27,46.35 | v52.7,36.83 55.24,34.29 57.78,34.29 58.42,33.66 59.05,33.66 | IC14.15 59.05,33.66 | 87,33.66 IC18.18 | 87,33.66 83.19,33.66 81.92,34.92 77.47,34.92 76.2,33.66 59.05,33.66 | 114.94,33.66 IC23.15 | 114.94,33.66 113.03,33.66 111.76,34.92 107.95,34.92 106.68,33.66 87,33.66 | IC27.18 142.88,33.66 139.06,33.66 137.79,34.92 133.35,34.92 132.08,33.66 114.94,33.66 | 114.94,84.45 114.3,84.45 113.67,85.09 111.12,85.09 110.49,84.45 90.81,84.45 IC8.18 87,84.45 83.19,84.45 81.92,85.72 77.47,85.72 76.2,84.45 62.87,84.45 IC4.15 | IC33.15 114.94,84.45 | IC37.18 142.88,84.45 139.06,84.45 137.79,85.72 133.35,85.72 132.08,84.45 114.94,84.45 | v57.78,76.2 v33.02,76.2 24.13,76.2 v22.23,78.11
ADATA9  (via drill 0.25)
  Top 0.127: IC8.16 94.61,85.72 v94.61,81.28 | v144.15,81.92 v146.69,84.45 | IC18.16 94.61,34.92 v94.61,30.48 | v114.94,33.02 114.3,32.38 IC23.1 | IC40.17 34.29,46.99 v34.29,28.57 | IC44.17 36.2,74.3 v36.2,76.83 | RN4.3 23.5,102.23 v23.5,78.11 v23.5,50.16 | v83.19,81.28 81.92,80.01 v80.64,80.01
  Route2 0.127: IC27.16 147.32,33.02 138.43,33.02 137.16,34.29 v135.89,34.29
  Route15 0.127: IC18.16 92.08,37.47 83.19,37.47 75.56,29.84 60.33,29.84 IC14.1
  Bottom 0.127: IC37.16 147.96,84.45 v146.69,84.45 | v144.15,81.92 143.51,81.28 139.06,81.28 137.79,80.01 135.89,80.01 134.62,81.28 116.84,81.28 IC33.1 112.39,78.74 109.86,81.28 v94.61,81.28 v83.19,81.28 | v94.61,30.48 109.86,30.48 111.12,29.21 113.03,29.21 IC23.1 | v135.89,34.29 134.62,33.02 v114.94,33.02 | v34.29,28.57 35.56,29.84 53.34,29.84 55.24,27.94 IC14.1 | v23.5,78.11 24.77,76.83 v36.2,76.83 56.52,76.83 IC4.1 60.96,81.28 79.38,81.28 v80.64,80.01 | IC40.17 33.66,50.16 v23.5,50.16
ADATA10  (via drill 0.25)
  Top 0.127: v43.18,43.18 IC40.16 | v31.11,75.56 26.67,75.56 v26.67,88.9 RN4.4 | v22.86,50.8 22.23,51.44 v22.23,75.56
  Bottom 0.127: v43.18,43.18 44.45,41.91 44.45,37.47 71.75,37.47 | IC14.10 71.75,37.47 | 97.16,37.47 IC18.14 | 71.75,37.47 97.16,37.47 | 127.64,37.47 IC23.10 | 97.16,37.47 127.64,37.47 | IC27.14 153.03,37.47 127.64,37.47 | IC44.16 36.2,75.56 v31.11,75.56 v22.23,75.56 | 97.16,88.27 75.56,88.27 IC4.10 71.12,88.9 v26.67,88.9 | IC8.14 97.16,88.27 | 127.64,88.27 IC33.10 | 97.16,88.27 127.64,88.27 | IC37.14 153.03,88.27 127.64,88.27 | IC40.16 35.56,50.8 v22.86,50.8
ADATA11  (via drill 0.25)
  Top 0.127: IC23.9 131.44,36.2 131.44,38.1 v130.81,38.73 | v104.78,38.1 104.14,37.47 IC18.12 | IC8.12 104.78,85.72 v104.78,83.19 | v131.44,83.19 132.08,83.82 IC33.9 | v136.53,86.36 v139.06,83.82 | 29.21,82.55 29.21,78.11 31.75,75.56 31.75,73.03 33.02,71.75 | 29.21,82.55 RN4.5 | v34.29,70.48 33.02,71.75 | v36.83,59.69 36.83,52.07 IC40.15 40.64,46.35 43.81,43.18 v46.35,43.18 | v36.2,62.87 36.83,63.5 36.83,66.67 33.02,70.48 33.02,71.75 | IC4.9 75.56,85.72 v75.56,83.19 | 29.21,82.55 v31.11,82.55 | IC14.9 77.47,36.83 v77.47,43.18
  Route2 0.127: IC14.9 76.2,36.2 77.47,37.47 102.23,37.47 IC18.12 | IC27.12 158.12,37.47 142.24,37.47 141.6,36.83 133.35,36.83 IC23.9 | v83.82,83.19 80.64,86.36 IC4.9
  Bottom 0.127: v130.81,38.73 130.18,38.1 v104.78,38.1 | v131.44,83.19 130.18,83.19 129.54,82.55 105.41,82.55 v104.78,83.19 v83.82,83.19 | IC37.12 157.48,83.82 v139.06,83.82 | IC33.9 v136.53,86.36 | v34.29,70.48 37.47,70.48 IC44.15 | v36.83,59.69 36.83,62.87 v36.2,62.87 | v75.56,83.19 57.15,83.19 56.52,82.55 v31.11,82.55 | v77.47,43.18 61.59,43.18 59.69,41.27 59.69,38.73 54.61,38.73 50.16,43.18 v46.35,43.18
ADATA12  (via drill 0.25)
  Top 0.127: v37.47,69.85 34.29,73.03 34.29,75.56 31.75,78.11 31.75,96.52 | RN4.6 31.75,96.52 | v32.38,96.52 31.75,96.52 | v55.24,46.99 54.61,47.62 54.61,66.04 v55.24,66.67
  Bottom 0.127: IC40.14 45.09,46.35 54.61,46.35 v55.24,46.99 57.78,46.99 58.42,46.35 59.05,46.35 | IC13.15 59.05,46.35 | 87,46.35 IC17.18 | 87,46.35 82.55,46.35 81.92,46.99 76.83,46.99 76.2,46.35 59.05,46.35 | 114.94,46.35 IC24.15 | 114.94,46.35 113.67,46.35 112.39,47.62 107.95,47.62 106.68,46.35 87,46.35 | IC28.18 142.88,46.35 139.06,46.35 137.79,47.62 133.35,47.62 132.08,46.35 114.94,46.35 | 39.37,69.85 IC44.14 | v37.47,69.85 39.37,69.85 | 62.87,97.16 63.5,96.52 79.38,96.52 80.64,97.79 83.19,97.79 83.82,97.16 87,97.16 | 62.87,97.16 IC3.15 | IC7.18 87,97.16 | 114.94,97.16 IC34.15 | 114.94,97.16 113.67,97.16 112.39,98.42 107.95,98.42 106.68,97.16 87,97.16 | IC38.18 142.88,97.16 139.06,97.16 137.79,98.42 133.35,98.42 132.08,97.16 114.94,97.16 | v32.38,96.52 53.34,96.52 55.24,98.42 57.15,98.42 58.42,97.16 62.87,97.16 | v55.24,66.67 52.07,69.85 39.37,69.85
ADATA13  (via drill 0.25)
  Top 0.127: v94.61,94.61 93.98,95.25 IC7.16 | IC38.16 146.05,102.87 134.62,102.87 v134.62,101.6 | v122.56,101.6 118.11,101.6 118.11,95.25 IC34.1 | v94.61,43.18 93.98,43.81 IC17.16 | v34.29,94.61 RN4.7 | v50.8,43.18 IC40.13 | v57.15,66.67 57.15,59.69 57.78,59.05 57.78,54.61 57.15,53.98 57.15,46.99 58.42,45.72 IC13.1 | v55.88,91.44 54.61,90.17 v54.61,74.93
  Route2 0.127: IC28.16 147.96,50.16 135.89,50.16 131.44,45.72 119.38,45.72 IC24.1 | IC17.16 93.98,48.9 92.71,50.16 80.01,50.16 72.39,42.55 60.33,42.55 IC13.1
  Route15 0.127: v94.61,94.61 92.71,94.61 92.08,93.98 v88.27,93.98
  Bottom 0.127: IC34.1 113.03,92.71 107.31,92.71 105.41,94.61 v94.61,94.61 | v122.56,101.6 v134.62,101.6 | IC24.1 113.67,41.27 108.58,41.27 106.68,43.18 v94.61,43.18 | v34.29,94.61 35.56,93.34 54.61,93.34 55.88,92.08 | 55.88,92.08 56.52,91.44 IC3.1 60.96,93.98 78.74,93.98 80.01,92.71 81.92,92.71 83.19,93.98 v88.27,93.98 | v50.8,43.18 53.34,40.64 IC13.1 | IC44.13 48.9,70.48 50.16,70.48 | 50.16,70.48 52.07,70.48 55.88,66.67 v57.15,66.67 | v55.88,91.44 55.88,92.08 | 50.16,70.48 v54.61,74.93
ADATA14  (via drill 0.25)
  Top 0.127: IC44.12 50.16,75.56 52.07,75.56 v52.07,53.34 | IC3.10 78.74,93.98 v78.74,50.16
  Bottom 0.127: 97.16,100.97 75.56,100.97 IC3.10 73.03,99.06 70.48,101.6 60.96,101.6 60.96,104.78 59.69,106.05 49.53,106.05 48.9,105.41 37.47,105.41 35.56,107.31 35.56,108.58 34.29,109.86 33.02,109.86 33.02,106.68 RN4.8 | IC7.14 97.16,100.97 | 127.64,100.97 IC34.10 | 97.16,100.97 127.64,100.97 | IC38.14 153.03,100.97 127.64,100.97 | IC40.12 50.16,50.16 52.07,50.16 | 71.75,50.16 52.07,50.16 | IC13.10 71.75,50.16 | 99.06,50.16 IC17.14 | 71.75,50.16 v78.74,50.16 99.06,50.16 | 52.07,50.16 v52.07,53.34 | 127.64,50.16 IC24.10 | 99.06,50.16 127.64,50.16 | IC28.14 153.03,50.16 127.64,50.16
ADATA15  (via drill 0.25)
  Top 0.127: IC44.11 49.53,72.39 49.53,49.53 IC40.11 52.07,46.99 v52.07,45.72 | 75.56,48.9 74.93,49.53 74.93,95.25 v73.03,97.16 | 75.56,48.9 IC13.9 | v73.03,45.72 75.56,48.26 75.56,48.9 | IC17.12 104.78,48.9 v104.78,51.44 | 132.08,50.8 v131.44,51.44 | IC24.9 132.08,50.8 | IC28.12 159.38,47.62 v159.38,45.72 | v140.34,45.72 138.43,47.62 v138.43,48.26 | IC7.12 105.41,97.79 v105.41,96.52 | v131.44,95.25 132.08,95.89 IC34.9 132.08,101.6 v132.72,102.23 | 132.08,50.8 133.35,52.07 133.35,69.85 134.62,71.12 134.62,93.34 133.99,93.98 v133.99,95.25 | IC3.9 78.74,96.52 78.74,95.89 79.38,95.25 82.55,95.25 v82.55,95.89
  Bottom 0.127: IC3.9 74.3,97.16 v73.03,97.16 69.85,97.16 69.85,99.69 68.58,100.97 52.7,100.97 52.07,101.6 40.64,101.6 RN4.9 | v52.07,45.72 53.34,44.45 59.05,44.45 60.33,45.72 v73.03,45.72 | v131.44,51.44 v104.78,51.44 | v140.34,45.72 v159.38,45.72 | IC24.9 v138.43,48.26 | IC38.12 157.48,101.6 135.25,101.6 134.62,102.23 v132.72,102.23 | v133.99,95.25 v131.44,95.25 106.68,95.25 v105.41,96.52 83.19,96.52 v82.55,95.89
ADDR0  (via drill 0.25)
  Top 0.127: IC20.9 106.05,4.45 v106.05,5.08 | v138.43,5.71 138.43,6.35 v134.62,6.35 134.62,19.68 135.25,20.32 135.25,52.07 | 135.25,52.07 v135.25,56.52 | 135.25,52.07 v139.06,55.88 | v79.38,19.68 79.38,11.43 v84.45,6.35
  Bottom 0.127: v134.62,6.35 107.31,6.35 v106.05,5.08 104.14,6.99 85.09,6.99 v84.45,6.35 | v138.43,5.71 143.51,5.71 144.15,5.08 157.48,5.08 IC25.9 | IC10.9 106.05,55.24 110.49,55.24 111.12,54.61 113.03,54.61 114.94,56.52 v135.25,56.52 | IC35.9 157.48,55.88 v139.06,55.88 | X1.A3 6.35,21.59 13.34,21.59 13.97,20.95 31.75,20.95 32.38,21.59 34.29,21.59 35.56,20.32 53.98,20.32 55.24,21.59 57.15,21.59 59.05,19.68 v79.38,19.68
ADDR1  (via drill 0.25)
  Top 0.127: IC25.7 155.57,3.17 155.57,8.89 156.21,9.53 156.21,48.9 154.94,50.16 IC35.7 | IC20.7 97.79,3.81 97.79,48.9 99.06,50.16 IC10.7 | X1.A4 3.81,26.67 3.81,28.57 4.45,29.21 8.89,29.21 v8.89,14.61
  Route2 0.127: v146.69,4.45 139.06,4.45 137.79,3.17 133.35,3.17 132.08,4.45 113.67,4.45 110.49,1.27 100.33,1.27 IC20.7
  Route15 0.127: v76.83,6.35 81.92,1.27 97.79,1.27 IC20.7
  Bottom 0.127: v8.89,14.61 8.89,8.89 13.34,8.89 13.97,8.26 31.75,8.26 32.38,8.89 34.92,8.89 35.56,8.26 54.61,8.26 55.24,8.89 57.15,8.89 59.69,6.35 v76.83,6.35 | IC25.7 153.03,4.45 v146.69,4.45
ADDR2  (via drill 0.25)
  Top 0.127: IC25.5 149.22,3.17 149.22,8.89 148.59,9.53 148.59,52.07 IC35.5 | IC20.5 93.34,3.17 93.34,8.89 92.71,9.53 92.71,18.41 | 92.71,18.41 92.71,48.9 93.98,50.16 IC10.5 | X1.A5 6.35,26.67 v6.35,18.41 | 92.71,18.41 v89.53,18.41
  Route2 0.127: IC25.5 149.86,1.91 148.59,0.64 129.54,0.64 v128.27,1.91
  Route15 0.127: v76.83,19.05 80.01,22.23 82.55,22.23 86.36,18.41 v89.53,18.41
  Bottom 0.127: v6.35,18.41 6.35,17.14 6.99,16.51 13.34,16.51 14.61,17.78 31.11,17.78 32.38,16.51 34.29,16.51 36.2,18.41 54.61,18.41 55.24,19.05 v76.83,19.05 | v128.27,1.91 127,0.64 95.89,0.64 IC20.5
ADDR3  (via drill 0.25)
  Top 0.127: IC25.3 144.78,8.26 143.51,9.53 143.51,50.16 | 143.51,50.16 143.51,52.07 IC35.3 | IC20.3 87.63,3.81 87.63,38.1 | 87.63,38.1 87.63,52.07 IC10.3 | X1.A6 6.35,31.75 11.43,31.75 v11.43,31.11 | 87.63,38.1 v85.72,38.1 | 143.51,50.16 137.79,50.16 v137.79,49.53
  Route2 0.127: v51.44,31.11 59.05,38.73 85.09,38.73 v85.72,38.1
  Route15 0.127: v137.79,49.53 131.44,55.88 113.67,55.88 108.58,50.8 91.44,50.8 IC10.3
  Bottom 0.127: v11.43,31.11 12.06,30.48 26.04,30.48 26.67,31.11 30.48,31.11 32.38,29.21 33.66,29.21 35.56,31.11 v51.44,31.11
ADDR4  (via drill 0.25)
  Top 0.127: 104.78,15.88 IC19.9 | v104.78,18.41 104.78,15.88 | v132.72,19.68 133.99,20.95 133.99,34.92 134.62,35.56 134.62,62.87 137.79,66.04 | 137.79,66.04 140.34,68.58 v140.34,69.22 | 137.79,66.04 v134.62,69.22 | v69.22,25.4 74.3,25.4 v74.3,24.77 | 104.78,15.88 v99.69,20.95
  Route2 0.127: IC26.9 160.02,15.88 158.75,17.14 139.06,17.14 137.79,15.88 136.53,15.88 v132.72,19.68
  Route15 0.127: v31.11,21.59 v29.84,20.32
  Bottom 0.127: v104.78,18.41 105.41,19.05 120.02,19.05 120.65,19.68 v132.72,19.68 | v140.34,69.22 156.84,69.22 IC36.9 | IC9.9 106.05,64.14 114.3,64.14 115.57,65.41 115.57,69.22 v134.62,69.22 | X1.A7 3.81,31.75 3.81,19.05 21.59,19.05 22.86,20.32 v29.84,20.32 | v31.11,21.59 31.75,22.23 34.29,22.23 35.56,20.95 52.07,20.95 56.52,25.4 v69.22,25.4 | v74.3,24.77 93.98,24.77 95.25,23.5 95.25,20.95 v99.69,20.95
ADDR5  (via drill 0.25)
  Top 0.127: v161.93,17.14 164.47,19.68 v164.47,62.23 | IC19.7 99.06,20.95 100.33,22.23 100.33,64.77 IC9.7
  Route2 0.127: X1.A8 6.35,34.29 13.34,34.29 22.86,24.77 31.11,24.77 38.73,17.14 53.98,17.14 55.24,15.88 57.15,15.88 62.23,20.95 80.64,20.95 81.28,21.59 82.55,21.59 87,17.14 97.16,17.14 97.79,16.51 | IC19.7 97.79,16.51 | IC26.7 154.31,15.24 152.4,13.34 110.49,13.34 106.05,17.78 99.06,17.78 97.79,16.51
  Bottom 0.127: IC26.7 156.84,17.14 v161.93,17.14 | v164.47,62.23 163.19,63.5 160.66,63.5 158.75,65.41 158.75,66.67 157.48,67.94 156.84,67.94 IC36.7
ADDR6  (via drill 0.25)
  Top 0.127: IC26.5 151.13,16.51 151.13,64.77 IC36.5 | 95.25,16.51 IC19.5 | 95.25,16.51 95.25,61.59 93.98,62.87 IC9.5 | v95.89,7.62 95.25,8.26 95.25,16.51
  Route15 0.127: v14.61,37.47 17.78,34.29 24.77,34.29 34.29,24.77 53.98,24.77 61.59,17.14 80.01,17.14 83.82,13.34 90.17,13.34 90.81,13.97 92.71,13.97 IC19.5 | IC26.5 146.69,12.06 144.15,12.06 143.51,11.43 137.79,11.43 v135.25,8.89
  Bottom 0.127: X1.A9 6.35,36.83 12.06,36.83 12.7,37.47 v14.61,37.47 | v135.25,8.89 133.99,7.62 113.67,7.62 112.39,8.89 107.95,8.89 106.68,7.62 v95.89,7.62
ADDR7  (via drill 0.25)
  Top 0.127: IC9.3 88.9,62.87 90.17,61.59 90.17,22.23 88.9,20.95 IC19.3 90.17,13.97 | 90.17,13.97 v90.81,13.34 | v139.7,68.58 138.43,69.85 133.99,69.85 133.99,35.56 133.35,34.92 133.35,20.95 128.27,15.88 v128.27,13.97 | v30.48,36.83 31.75,35.56 31.75,23.5 36.2,19.05 v36.2,17.14 | v79.38,6.99 79.38,5.08 83.82,0.64 90.17,0.64 90.17,13.97
  Route15 0.127: IC26.3 142.88,13.34 128.91,13.34 v128.27,13.97
  Bottom 0.127: v128.27,13.97 127.64,13.34 v90.81,13.34 | IC36.3 142.24,68.58 v139.7,68.58 | X1.A10 3.81,39.37 3.81,34.29 13.97,34.29 16.51,36.83 v30.48,36.83 | v36.2,17.14 45.72,17.14 46.99,15.88 46.99,12.06 54.61,12.06 59.69,6.99 v79.38,6.99
ADDR8  (via drill 0.25)
  Top 0.127: 104.14,31.75 104.14,33.66 105.41,34.92 105.41,55.24 107.95,57.78 107.95,60.96 108.58,61.59 108.58,69.22 | 104.14,31.75 IC18.9 | 108.58,69.22 108.58,74.3 IC8.9 | IC27.9 159.38,28.57 v159.38,30.48 | v139.06,30.48 137.79,31.75 v135.89,31.75 | 104.14,31.75 v107.31,31.75 | v165.1,30.48 v165.1,72.39 | X1.A11 3.17,45.09 3.17,55.88 v4.45,57.15 | v80.64,59.69 81.28,60.33 81.28,66.67 v82.55,67.94 | 108.58,69.22 v107.31,69.22
  Route2 0.127: IC37.9 160.02,77.47 v165.1,72.39
  Bottom 0.127: v139.06,30.48 v159.38,30.48 v165.1,30.48 | v107.31,31.75 v135.89,31.75 | v4.45,57.15 41.91,57.15 42.55,56.52 53.34,56.52 55.24,54.61 57.78,54.61 60.96,57.78 78.74,57.78 v80.64,59.69 | v82.55,67.94 83.82,69.22 v107.31,69.22
ADDR9  (via drill 0.25)
  Top 0.127: v165.1,29.84 165.74,30.48 v165.74,76.2 | v155.57,76.83 154.94,77.47 IC37.7 | v102.23,29.84 102.87,30.48 102.87,55.88 | 102.87,55.88 102.87,70.48 100.33,73.03 100.33,77.47 IC8.7 | 102.87,55.88 v103.5,55.88
  Route15 0.127: v52.07,44.45 59.05,51.44 79.38,51.44 v83.19,55.24 | v155.57,76.83 148.59,76.83 147.32,75.56 102.23,75.56 IC8.7
  Bottom 0.127: IC27.7 156.84,29.84 v165.1,29.84 | v165.74,76.2 165.1,76.83 v155.57,76.83 | IC18.7 100.97,29.84 v102.23,29.84 | X1.A12 6.35,44.45 v52.07,44.45 | v83.19,55.24 83.82,55.88 v103.5,55.88
ADDR10  (via drill 0.25)
  Top 0.127: v111.76,28.57 113.67,30.48 v113.67,32.38 113.67,34.29 113.03,34.92 113.03,36.2 113.67,36.83 113.67,39.37 113.03,40.01 113.03,41.27 113.67,41.91 113.67,46.99 113.03,47.62 113.03,52.07 v111.76,53.34 | v140.34,32.38 140.97,31.75 v140.97,29.21 | v16.51,49.53 20.32,45.72 v20.32,33.66 | v113.67,76.83 113.03,76.2 113.03,73.03 113.67,72.39 113.67,67.31 113.03,66.67 113.03,64.14 115.57,61.59 v115.57,57.15
  Route2 0.127: v78.11,30.48 82.55,26.04 92.08,26.04 IC18.5 | v111.76,53.34 v115.57,57.15
  Route15 0.127: v128.27,79.38 129.54,80.64 135.25,80.64 139.06,76.83 147.96,76.83 IC37.5
  Bottom 0.127: IC8.5 95.89,80.64 109.86,80.64 v113.67,76.83 127,76.83 128.27,78.11 v128.27,79.38 | IC18.5 95.89,26.04 101.6,26.04 102.87,27.3 102.87,29.84 109.86,29.84 111.12,28.57 v111.76,28.57 | v113.67,32.38 134.62,32.38 136.53,34.29 137.79,34.29 139.7,32.38 v140.34,32.38 | v140.97,29.21 141.6,29.84 147.96,29.84 IC27.5 | X1.A13 6.35,49.53 v16.51,49.53 | v20.32,33.66 30.48,33.66 32.38,31.75 52.7,31.75 55.24,29.21 57.78,29.21 59.05,30.48 v78.11,30.48
ADDR11  (via drill 0.25)
  Top 0.127: IC27.3 145.41,28.57 v145.41,33.66 | v166.37,67.31 v166.37,33.02 | v147.96,71.12 146.05,73.03 146.05,77.47 IC37.3 | 80.64,37.47 81.92,38.73 81.92,40.64 84.45,43.18 85.72,43.18 85.72,46.99 85.09,47.62 85.09,57.78 87.63,60.33 87.63,77.47 IC8.3 | 80.64,37.47 v80.01,36.83 | v47.62,45.72 52.07,41.27 v52.07,40.64 | 80.64,37.47 v80.01,38.1
  Route2 0.127: v80.01,36.83 IC18.3 | IC37.3 143.51,80.01 141.6,80.01 138.43,83.19 138.43,85.09 135.25,88.27 110.49,88.27 102.87,80.64 90.81,80.64 IC8.3
  Bottom 0.127: v145.41,33.66 146.05,33.02 v166.37,33.02 | v166.37,67.31 162.56,71.12 v147.96,71.12 | X1.A14 3.81,49.53 3.81,46.99 26.67,46.99 27.94,45.72 v47.62,45.72 | v52.07,40.64 54.61,38.1 v80.01,38.1
ADDR12  (via drill 0.25)
  Top 0.127: v167,90.81 v167,43.81 | v104.14,44.45 IC17.9 | v114.3,44.45 115.57,45.72 115.57,50.16 113.03,52.7 113.03,59.69 110.49,62.23 110.49,77.47 105.41,82.55 105.41,90.17 IC7.9 | X1.A15 6.35,54.61 11.43,54.61 v11.43,53.98 | v45.09,55.24 46.99,55.24 46.99,47.62 v51.44,43.18 | v80.01,45.09 80.64,44.45 85.09,44.45 v85.09,43.81 | v141.6,42.55 138.43,42.55 138.43,43.81 137.79,44.45 135.89,44.45 v135.89,45.09
  Bottom 0.127: v167,43.81 163.19,43.81 IC28.9 157.48,43.18 142.24,43.18 v141.6,42.55 | v167,90.81 165.74,89.53 161.93,89.53 IC38.9 | v11.43,53.98 26.67,53.98 27.94,55.24 v45.09,55.24 | v51.44,43.18 52.7,41.91 57.15,41.91 60.33,45.09 v80.01,45.09 | v85.09,43.81 85.72,44.45 v104.14,44.45 v114.3,44.45 122.56,44.45 123.19,45.09 v135.89,45.09
ADDR13  (via drill 0.25)
  Top 0.127: v99.06,45.72 IC17.7 | v97.79,49.53 97.79,90.17 IC7.7 | v70.48,50.8 72.39,48.9 v72.39,44.45
  Route2 0.127: v99.06,45.72 97.79,46.99 v97.79,49.53 | IC28.7 152.4,43.18 139.7,43.18 137.79,41.27 133.99,41.27 130.18,45.09 v122.56,45.09 | IC38.7 153.03,89.53 100.97,89.53 IC7.7
  Bottom 0.127: v122.56,45.09 114.3,45.09 112.39,46.99 107.95,46.99 106.68,45.72 v99.06,45.72 98.42,45.09 85.72,45.09 82.55,41.91 80.64,41.91 78.74,43.81 73.03,43.81 v72.39,44.45 | X1.A16 6.35,54.61 26.67,54.61 27.94,55.88 50.16,55.88 52.7,53.34 52.7,50.8 v70.48,50.8
ADDR14  (via drill 0.25)
  Top 0.127: IC28.5 150.5,41.27 v150.5,46.35 | v168.28,46.35 168.28,85.09 168.91,85.72 168.91,90.81 v165.74,93.98 | v92.71,49.53 92.71,87 93.98,88.27 IC7.5 95.25,92.71 95.25,106.05 109.22,106.05 109.86,105.41 v113.67,105.41 | X1.A17 3.17,60.33 v3.17,81.92 | IC38.5 143.51,97.79 v143.51,102.23
  Route2 0.127: IC17.5 92.71,41.91 v92.71,49.53
  Route15 0.127: v60.33,88.27 69.85,88.27 71.12,89.53 92.08,89.53 IC7.5
  Bottom 0.127: v168.28,46.35 v150.5,46.35 | v165.74,93.98 152.4,93.98 IC38.5 | v3.17,81.92 3.17,85.09 20.32,85.09 23.5,88.27 v60.33,88.27 | v143.51,102.23 139.06,106.68 116.2,106.68 114.94,105.41 v113.67,105.41
ADDR15  (via drill 0.25)
  Top 0.127: v120.02,88.9 120.65,88.27 120.65,59.05 123.19,56.52 123.19,39.37 v123.83,38.73 | v14.61,62.23 15.24,62.87 v15.24,88.27 | v79.38,95.89 80.01,96.52 80.01,97.16 83.82,100.97 87.63,100.97 87.63,96.52 88.9,95.25 IC7.3
  Route2 0.127: v123.83,38.73 125.09,37.47 141.6,37.47 IC28.3
  Route15 0.127: IC38.3 144.78,90.81 142.88,88.9 v120.02,88.9
  Bottom 0.127: IC17.3 90.81,42.55 91.44,42.55 92.71,41.27 92.71,38.73 v123.83,38.73 | IC7.3 90.81,93.34 99.06,93.34 100.33,92.08 100.33,88.9 v120.02,88.9 | X1.A18 6.35,62.23 v14.61,62.23 | v15.24,88.27 15.24,96.52 28.57,96.52 29.84,97.79 31.11,97.79 31.75,97.16 31.75,95.89 53.34,95.89 55.24,97.79 57.15,97.79 59.05,95.89 v79.38,95.89
ADDR-ID0  (via drill 0.25)
  Top 0.127: IC41.2 36.2,92.08 36.2,97.16 IC41.14 | X1.B9 8.89,39.37 8.89,46.35 9.53,46.99 11.43,46.99 v11.43,48.26 | v14.61,48.26 13.97,48.9 v13.97,85.72
  Bottom 0.127: v14.61,48.26 v11.43,48.26 | v13.97,85.72 19.68,91.44 31.11,91.44 33.02,93.34 33.66,93.34 IC41.2
ADDR-ID1  (via drill 0.25)
  Top 0.127: IC41.3 40.64,93.98 IC41.13 | v12.7,85.72 v12.7,41.91
  Bottom 0.127: X1.B10 8.89,41.91 v12.7,41.91 | v12.7,85.72 12.7,99.06 31.11,99.06 33.02,97.16 38.73,97.16 IC41.13
ADDR-REG-ADDR-RD  (via drill 0.25)
  Top 0.127: IC48.11 49.53,87.63 49.53,102.23 48.26,103.5 48.26,107.31 47.62,107.95 40.64,107.95 40.64,108.58 38.73,110.49 15.88,110.49 15.88,49.53 17.78,47.62 v17.78,43.81
  Bottom 0.127: v17.78,43.81 15.24,41.27 10.79,41.27 X1.C10
ADDR-REG-DATA-RD-HI  (via drill 0.25)
  Top 0.127: IC39.10 v87,107.31 90.17,107.31 v90.17,62.23 | v124.46,106.05 127,108.58 IC29.10 | IC12.10 23.5,10.79 23.5,13.97 22.86,14.61 22.86,29.84 18.41,34.29 v18.41,38.1
  Route15 0.127: v90.17,62.23 90.17,58.42 74.3,42.55 57.15,42.55 52.07,37.47 47.62,37.47 IC1.10
  Bottom 0.127: v87,107.31 88.9,105.41 92.08,105.41 93.34,106.68 111.76,106.68 113.67,104.78 115.57,104.78 116.84,106.05 v124.46,106.05 | X1.C9 v18.41,38.1 43.18,38.1 IC1.10
ADDR-REG-DATA-RD-LO  (via drill 0.25)
  Top 0.127: v90.81,103.5 94.61,107.31 113.03,107.31 113.67,107.95 116.84,107.95 116.84,109.22 IC29.13 | v12.06,14.61 12.06,33.66 X1.C8 | IC39.13 73.03,109.86 71.12,109.86 69.85,111.12 v66.04,111.12 | v55.88,109.86 55.24,109.22 50.16,109.22 47.62,111.76 15.24,111.76 15.24,88.9 13.34,87 13.34,41.27 15.88,38.73 15.88,24.13 15.24,23.5 15.24,11.43 IC12.13
  Route2 0.127: v66.04,111.12 64.77,109.86 v55.88,109.86
  Route15 0.127: IC39.13 80.64,106.05 88.27,106.05 v90.81,103.5
  Bottom 0.127: v12.06,14.61 IC12.13 | IC1.13 36.2,37.47 15.24,37.47 14.61,36.83 12.7,36.83 11.43,35.56 X1.C8
ADDR-REG-DN  (via drill 0.25)
  Top 0.127: v16.51,17.14 IC2.13 16.51,45.72 v14.61,47.62
  Route15 0.127: IC50.13 IC50.5
  Bottom 0.127: v16.51,17.14 22.23,17.14 IC2.5 26.04,13.34 34.92,13.34 IC50.13 | X1.C13 10.79,47.62 v14.61,47.62
ADDR-REG-FUNC  (via drill 0.25)
  Top 0.127: v46.99,1.91 46.99,26.67 IC1.5
  Route15 0.127: IC29.6 129.54,102.87 112.39,85.72 107.95,85.72 102.87,80.64 97.16,80.64 74.3,57.78 64.14,57.78 52.7,46.35 52.07,46.35 46.99,41.27 46.99,38.73 44.45,36.2 44.45,29.21 IC1.5
  Bottom 0.127: IC12.4 23.5,0.64 45.72,0.64 v46.99,1.91
ADDR-REG-FUNC-LD  (via drill 0.25)
  Top 0.127: IC44.1 26.67,64.77 26.67,60.33 27.94,59.05 27.94,58.42 | 27.94,58.42 IC45.1 26.67,52.07 26.67,47.62 27.3,46.99 27.3,41.27 IC40.1 27.94,33.66 v27.3,33.02 | v57.78,106.68 53.34,106.68 v53.34,59.05 | 27.94,58.42 v28.57,58.42
  Bottom 0.127: IC49.2 94.61,106.05 93.34,106.05 92.08,104.78 88.9,104.78 87.63,106.05 71.12,106.05 70.48,105.41 68.58,105.41 67.31,106.68 v57.78,106.68 | v53.34,59.05 52.7,58.42 v28.57,58.42 | X1.C6 12.7,33.02 v27.3,33.02
ADDR-REG-FUNC-RD  (via drill 0.25)
  Top 0.127: IC49.1 92.71,102.87 v92.71,87.63
  Route15 0.127: v92.71,87.63 92.71,85.72 87.63,80.64 83.19,80.64 78.11,75.56 56.52,75.56 31.11,50.16 26.67,50.16 10.16,33.66 X1.C7
ADDR-REG-LD-HI
  Top 0.127: IC11.10 IC11.5 | IC11.13 IC11.2
  Route2 0.127: X1.C12 22.23,33.66 27.3,33.66 IC11.13
  Bottom 0.127: IC11.5 43.81,13.34 40.01,13.34 IC11.2
ADDR-REG-LD-LO  (via drill 0.25)
  Top 0.127: IC12.2 14.61,0.64 12.7,0.64 12.7,25.4 | 12.7,25.4 12.7,41.27 12.06,41.91 12.06,42.55 | 12.06,42.55 11.43,43.18 X1.C11 | 12.7,25.4 v15.24,25.4 | IC39.2 71.12,107.95 68.58,107.95 v68.58,108.58 | v14.61,106.05 12.06,103.5 12.06,42.55
  Bottom 0.127: IC39.2 76.83,102.23 117.47,102.23 IC29.2 | IC1.2 35.56,25.4 v15.24,25.4 | v68.58,108.58 67.94,109.22 48.9,109.22 46.99,111.12 19.68,111.12 v14.61,106.05
ADDR-REG-UP  (via drill 0.25)
  Top 0.127: IC50.10 44.45,8.89 44.45,0.64 40.01,0.64 IC50.2 36.2,0.64 25.4,0.64 25.4,14.61 | 25.4,14.61 v24.13,13.34 | 25.4,14.61 25.4,21.59 IC2.10 | v14.61,50.16 17.14,47.62 17.14,24.13 17.78,23.5 17.78,17.78 16.51,16.51 IC2.2
  Bottom 0.127: IC2.2 18.41,13.34 v24.13,13.34 | X1.C14 10.79,50.16 v14.61,50.16
DATA0  (via drill 0.25)
  Top 0.127: IC45.2 29.84,53.98 29.84,59.69 29.21,60.33 29.21,61.59 | 29.21,61.59 30.48,62.87 IC44.2 | 29.21,61.59 v27.3,63.5
  Bottom 0.127: X1.A19 6.35,64.77 24.13,64.77 25.4,63.5 v27.3,63.5
DATA1
  Top 0.127: IC45.3 32.38,53.98 32.38,59.69 31.75,60.33 31.75,64.77 IC44.3
  Bottom 0.127: X1.A20 6.35,67.31 27.3,67.31 27.94,67.94 31.11,67.94 IC44.3
DATA2  (via drill 0.25)
  Top 0.127: IC45.4 34.29,54.61 34.29,64.77 34.92,65.41 | IC44.4 34.92,65.41 | v31.11,69.85 34.92,66.04 34.92,65.41
  Bottom 0.127: X1.A21 6.35,69.85 v31.11,69.85
DATA3  (via drill 0.25)
  Top 0.127: IC45.5 37.47,53.98 37.47,59.69 36.83,60.33 36.83,62.87 38.1,64.14 IC44.5 v33.66,70.48
  Bottom 0.127: X1.A22 6.35,72.39 26.04,72.39 27.94,70.48 v33.66,70.48
DATA4  (via drill 0.25)
  Top 0.127: IC45.6 39.37,54.61 39.37,63.5 40.64,64.77 IC44.6 40.64,67.94 v37.47,71.12
  Bottom 0.127: X1.A23 6.35,74.93 21.59,74.93 23.5,73.03 26.04,73.03 27.94,71.12 v37.47,71.12
DATA5  (via drill 0.25)
  Top 0.127: IC45.7 43.18,59.05 41.91,60.33 41.91,64.77 IC44.7 41.27,67.94 41.27,71.75 v37.47,71.75
  Bottom 0.127: X1.A24 6.35,77.47 19.68,77.47 23.5,73.66 26.04,73.66 27.94,71.75 v37.47,71.75
DATA6
  Top 0.127: IC45.8 44.45,54.61 44.45,64.77 IC44.8
  Bottom 0.127: X1.A25 3.17,76.83 3.17,52.07 27.3,52.07 27.94,51.44 43.81,51.44 IC45.8
DATA7  (via drill 0.25)
  Top 0.127: IC45.9 48.26,59.05 46.99,60.33 46.99,61.59 48.26,62.87 IC44.9 48.26,67.94 v47.62,68.58 | v26.04,79.38 26.04,73.03 29.21,69.85 v29.21,68.58
  Bottom 0.127: X1.A26 6.35,80.01 25.4,80.01 v26.04,79.38 | v47.62,68.58 v29.21,68.58
DATA8  (via drill 0.25)
  Top 0.127: v19.68,52.7 17.14,55.24 v17.14,80.64
  Route2 0.127: IC40.2 26.67,44.45 26.67,45.72 v19.68,52.7
  Bottom 0.127: v17.14,80.64 15.24,82.55 6.35,82.55 X1.A27
DATA9  (via drill 0.25)
  Top 0.127: IC40.3 29.84,43.81 v29.84,46.35 | v11.43,48.9 10.79,49.53 3.81,49.53 3.81,53.98 4.45,54.61 5.71,54.61 6.35,55.24 6.35,61.59 5.71,62.23 3.81,62.23 3.81,85.09 X1.A28
  Bottom 0.127: v29.84,46.35 27.94,46.35 25.4,48.9 v11.43,48.9
DATA10  (via drill 0.25)
  Top 0.127: v11.43,61.59 10.79,62.23 6.35,62.23 6.35,87.63 X1.A29
  Route2 0.127: IC40.4 34.92,40.64 29.21,46.35 26.67,46.35 v11.43,61.59
DATA11  (via drill 0.25)
  Top 0.127: IC40.5 36.2,42.55 v36.2,43.18 | v8.26,39.37 2.54,39.37 2.54,88.9 X1.A30
  Bottom 0.127: v36.2,43.18 27.3,43.18 26.04,41.91 16.51,41.91 15.24,40.64 12.06,40.64 10.79,39.37 v8.26,39.37
DATA12  (via drill 0.25)
  Top 0.127: v19.05,41.27 17.78,40.01 v17.78,24.77
  Bottom 0.127: IC40.6 38.73,42.55 27.3,42.55 26.04,41.27 v19.05,41.27 | v17.78,24.77 11.43,24.77 10.79,24.13 8.89,24.13 X1.B3
DATA13  (via drill 0.25)
  Top 0.127: v26.04,27.3 v26.04,38.73
  Bottom 0.127: IC40.7 41.27,38.73 v26.04,38.73 | v26.04,27.3 25.4,26.67 8.89,26.67 X1.B4
DATA14  (via drill 0.25)
  Route15 0.127: IC40.8 45.72,39.37 43.81,37.47 34.92,37.47 29.21,31.75 v29.21,30.48
  Bottom 0.127: v29.21,30.48 26.67,30.48 25.4,29.21 8.89,29.21 X1.B5
DATA15  (via drill 0.25)
  Top 0.127: IC40.9 49.53,39.37 v49.53,33.02
  Bottom 0.127: v49.53,33.02 34.92,33.02 33.66,34.29 14.61,34.29 13.97,33.66 12.7,33.66 10.79,31.75 8.89,31.75 X1.B6
GND  (7 unrouted)
  pour Route15: 1.27,113.03 176.53,113.03 176.53,0 0,0 0,113.03
H/L-SWAP  (via drill 0.25)
  Top 0.127: v12.06,6.35 4.45,6.35 4.45,16.51 1.91,19.05 1.91,90.17 4.45,92.71 8.89,92.71 | 8.89,92.71 8.89,80.01 X1.C25 | v55.24,109.86 IC42.11 | v14.61,106.68 8.89,100.97 8.89,92.71
  Bottom 0.127: IC12.5 20.32,6.35 v12.06,6.35 | v55.24,109.86 48.9,109.86 46.99,111.76 19.68,111.76 v14.61,106.68
IREG0  (via drill 0.25)
  Top 0.127: IC39.12 76.2,110.49 76.2,103.5 74.93,102.23 73.03,102.23 73.03,103.5 IC39.1 | IC50.9 52.7,14.61 v52.7,36.2 | v64.77,49.53 64.77,101.6 IC42.6
  Route2 0.127: v52.7,36.2 64.77,48.26 v64.77,49.53
  Route15 0.127: IC39.9 83.19,109.86 79.38,109.86 IC39.12
  Bottom 0.127: IC11.1 38.1,12.7 | 38.1,12.7 IC50.12 | IC50.9 45.72,12.7 38.1,12.7 | IC42.6 64.14,106.05 67.31,106.05 69.22,104.14 IC39.1
IREG1  (via drill 0.25)
  Top 0.127: IC11.4 42.55,15.88 42.55,20.95 v41.91,21.59 | IC42.8 66.04,110.49 66.04,106.68 v67.31,105.41 | v107.31,101.6 116.84,101.6 IC29.1 116.84,106.68 IC29.12 | IC2.9 26.67,46.99 26.04,47.62 26.04,53.98 27.3,55.24 27.3,59.05 26.04,60.33 26.04,66.67 27.3,67.94 27.3,71.12 25.4,73.03 v25.4,78.11
  Route15 0.127: v25.4,78.11 31.11,83.82 46.99,83.82 67.31,104.14 v67.31,105.41
  Bottom 0.127: IC2.12 20.95,24.77 24.77,24.77 | IC2.9 24.77,24.77 | v41.91,21.59 41.91,24.77 24.77,24.77 | v67.31,105.41 71.12,101.6 v107.31,101.6 | IC29.9 127.64,109.86 123.83,109.86 IC29.12
N$1
  Bottom 0.127: IC42.12 56.52,109.86 68.58,109.86 69.22,110.49 71.75,110.49 72.39,109.86 90.17,109.86 90.81,110.49 93.34,110.49 93.98,109.86 104.78,109.86 IC49.9
N$2
  Top 0.127: IC22.4 IC21.13
N$3
  Top 0.127: IC22.5 IC21.12
N$4
  Top 0.127: IC23.4 IC22.13
N$5
  Top 0.127: IC23.5 IC22.12
N$6
  Top 0.127: IC24.4 IC23.13
N$7
  Top 0.127: IC24.5 IC23.12
N$8  (via drill 0.25)
  Top 0.127: IC21.11 125.73,11.43 125.73,21.59 | IC22.11 125.73,21.59 | v123.83,102.23 130.81,102.23 130.81,69.22 128.27,66.67 128.27,51.44 125.73,48.9 v125.73,41.91 | v125.09,38.73 125.09,36.83 125.73,36.2 125.73,21.59
  Bottom 0.127: v123.83,102.23 IC29.3 | v125.73,41.91 125.73,39.37 v125.09,38.73
N$9  (via drill 0.25)
  Top 0.127: IC2.8 31.75,22.86 31.75,17.14 36.83,12.06 v41.27,12.06 | v108.58,5.71 110.49,3.81 113.67,3.81 114.3,4.45 124.46,4.45 IC21.5
  Route2 0.127: v41.27,12.06 43.18,12.06 44.45,13.34 78.11,13.34 85.72,5.71 v108.58,5.71
N$10
  Top 0.127: IC5.4 IC6.13
N$11
  Top 0.127: IC5.5 IC6.12
N$12
  Top 0.127: IC4.4 IC5.13
N$13
  Top 0.127: IC4.5 IC5.12
N$14
  Top 0.127: IC3.4 IC4.13
N$15
  Top 0.127: IC3.5 IC4.12
N$16  (via drill 0.25)
  Top 0.127: IC1.3 41.91,29.21 v41.91,40.01 | v54.61,43.81 54.61,46.99 53.98,47.62 53.98,66.67 54.61,67.31 54.61,73.03 v56.52,74.93 | IC6.11 69.85,62.23 69.85,72.39 IC5.11
  Bottom 0.127: v41.91,40.01 41.91,43.81 v54.61,43.81 | v56.52,74.93 57.78,74.93 58.42,75.56 69.22,75.56 IC5.11
N$17  (via drill 0.25)
  Top 0.127: v47.62,4.45 49.53,6.35 49.53,10.79 53.34,14.61 v53.34,21.59 | v66.67,24.77 67.31,25.4 67.31,52.07 IC6.5
  Bottom 0.127: IC50.3 42.55,4.45 v47.62,4.45 | v53.34,21.59 56.52,24.77 v66.67,24.77
N$18  (via drill 0.25)
  Top 0.127: v54.61,3.81 57.78,3.81 62.23,8.26 64.77,8.26 64.77,48.9 66.04,50.16 IC6.4
  Bottom 0.127: IC50.6 50.16,4.45 53.98,4.45 v54.61,3.81
N$19  (via drill 0.25)
  Top 0.127: IC41.15 34.92,98.42 v34.92,95.25
  Bottom 0.127: J1.2 v34.92,95.25
N$20  (via drill 0.25)
  Top 0.127: v46.35,32.38 IC1.11 | v67.94,31.75 74.93,31.75 74.93,43.81 77.47,46.35 v77.47,52.07 | IC9.1 82.55,64.77 82.55,59.69 83.82,58.42 IC10.1
  Bottom 0.127: v46.35,32.38 54.61,32.38 55.24,31.75 v67.94,31.75 | v77.47,52.07 78.74,53.34 IC10.1
N$21  (via drill 0.25)
  Top 0.127: v79.38,54.61 79.38,74.3 80.01,74.93 | IC8.1 80.01,74.93 | IC7.1 80.01,87.63 80.01,74.93
  Route2 0.127: IC1.8 50.8,36.2 62.23,47.62 62.23,48.9 64.77,51.44 76.2,51.44 v79.38,54.61
N$22  (via drill 0.25)
  Top 0.127: v55.24,25.4 57.15,27.3 v57.15,41.27 | v67.94,44.45 69.85,46.35 69.85,57.78 72.39,60.33 72.39,85.09 | IC4.11 72.39,85.09 | IC3.11 72.39,97.79 72.39,85.09
  Bottom 0.127: IC11.11 45.72,25.4 v55.24,25.4 | v57.15,41.27 60.33,44.45 v67.94,44.45
N$23
  Route15 0.127: IC2.11 23.5,24.77 31.75,24.77 39.37,17.14 54.61,17.14 58.42,13.34 83.19,13.34 83.82,12.7 95.89,12.7 96.52,13.34 109.22,13.34 118.11,4.45 120.02,4.45 IC21.4
N$24
  Route2 0.127: IC39.6 84.45,104.14 81.28,100.97 24.13,100.97 20.95,97.79 J1.3
N$25  (via drill 0.25)
  Top 0.127: IC25.1 140.97,3.81 140.97,10.79 139.7,12.06 139.7,13.34 | IC26.1 139.7,13.34 | IC29.11 123.19,110.49 v123.19,57.78 | v121.92,57.15 120.65,55.88 v120.65,19.05 | 139.7,13.34 v135.25,17.78
  Bottom 0.127: v123.19,57.78 122.56,57.15 v121.92,57.15 | v120.65,19.05 121.92,17.78 v135.25,17.78
N$26  (via drill 0.25)
  Top 0.127: IC27.1 139.7,33.66 138.43,34.92 138.43,39.37 IC28.1 | IC29.8 132.08,106.05 133.35,104.78 133.35,70.48 130.81,67.94 130.81,43.81 v133.35,41.27
  Bottom 0.127: v133.35,41.27 133.99,40.64 IC28.1